# Altium project Apalis Evaluation Board.PrjPCB (part 2 of 5)

## Sheet JTAG.SchDoc: Apalis Evaluation Board 1.1
size A3; Organization: Toradex AG; Address1: Altsagenstrasse 5; Address2: Horw; Address3: 6048; Address4: Switzerland; DocumentNumber: 31; Revision: V1.1; SheetNumber: 31; SheetTotal: 32; PageSetup: Record=PageOptions|CenterHorizontal=True|CenterVertical=True|PrintScale=0.73|XCorrection=1.00|YCorrection=1.00|PrintKind=0|BorderSize=5000000|LeftOffset=0|BottomOffset=0|Orientation=2|PaperLength=1000|PaperWidth=1000|Scale=100|PaperSource=7|PrintQuality=-4|MediaType=1|DitherType=10|PaperKind=A4|PrintScaleMode=1
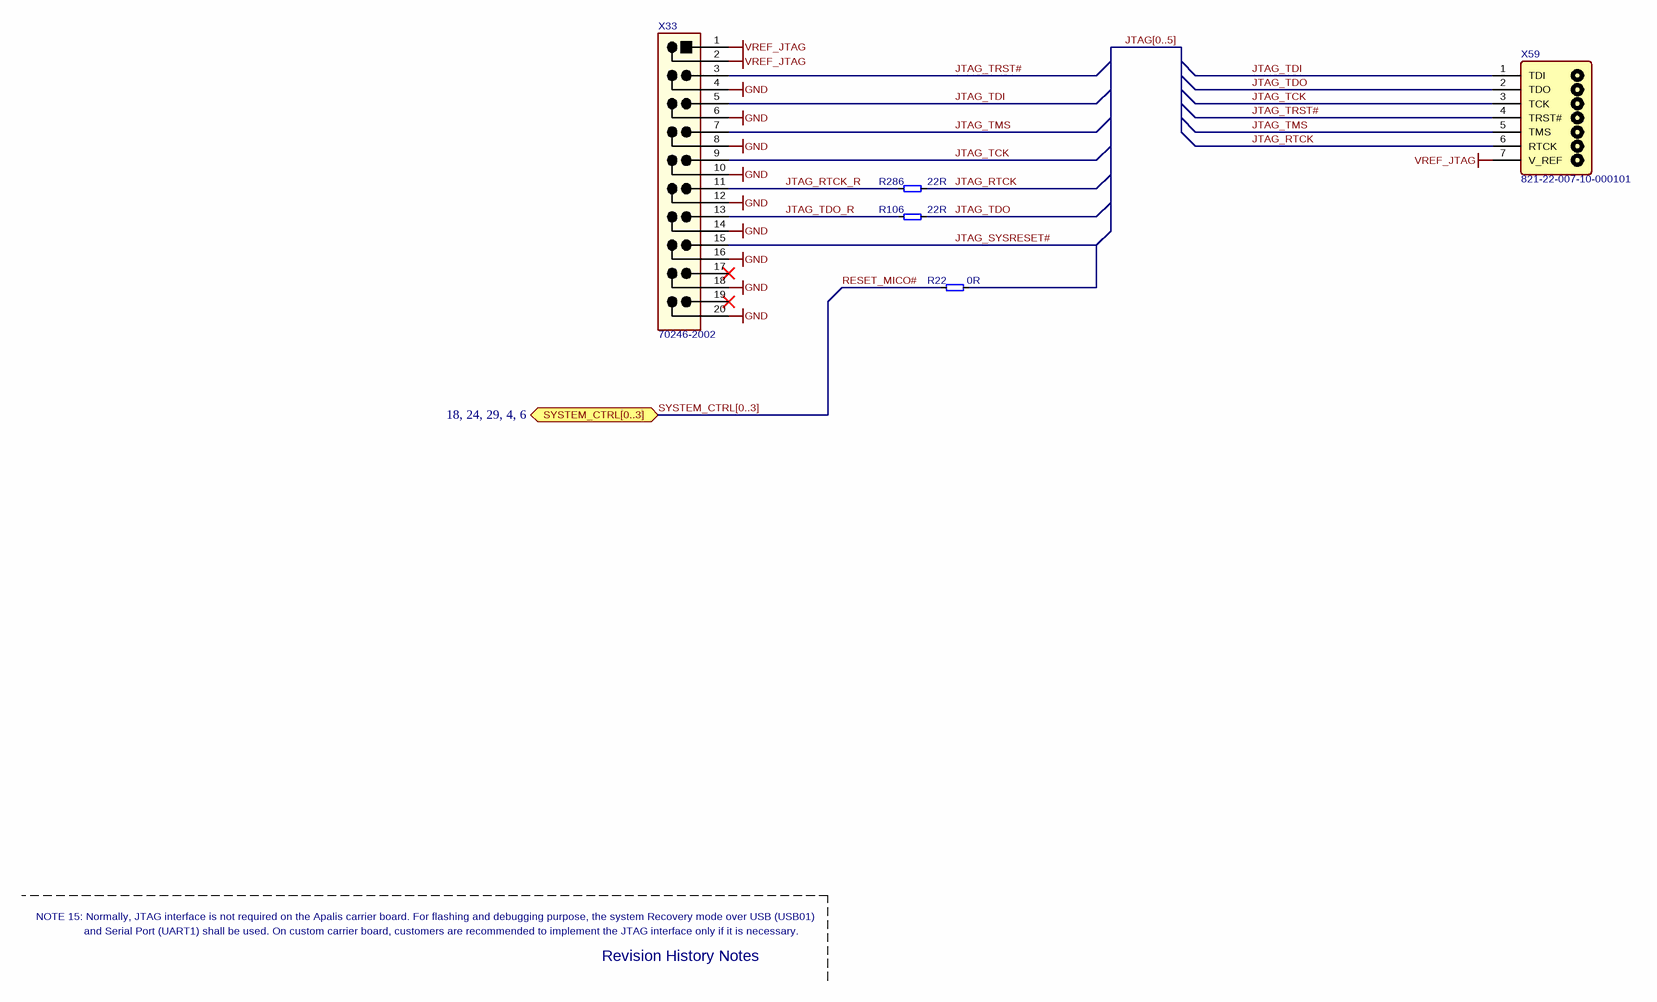
[diagram p9: JTAG.SchDoc]

### Parts
R22  0R  [T_RESC0603X30N]
R106  22R  [T_RESC0603X30N]
R286  22R  [T_RESC0603X30N]
X33  70246-2002  [T_Molex_70246-2002]
X59  821-22-007-10-000101  [T_MILL-MAX_821-22-007-10-000101]

### Ports
SYSTEM_CTRL[0..3] (bidir, see 18, 24, 29, 4, 6)

### Nets
GND: X33.4 X33.6 X33.8 X33.10 X33.12 X33.14 X33.16 X33.18 X33.20
VREF_JTAG: X33.1 X33.2 X59.7(V_REF)
JTAG_RTCK: R286.2 X59.6(RTCK)
JTAG_RTCK_R: R286.1 X33.11
JTAG_SYSRESET#: R22.2 X33.15
JTAG_TCK: X33.9 X59.3(TCK)
JTAG_TDI: X33.5 X59.1(TDI)
JTAG_TDO: R106.2 X59.2(TDO)
JTAG_TDO_R: R106.1 X33.13
JTAG_TMS: X33.7 X59.5(TMS)
JTAG_TRST#: X33.3 X59.4(TRST#)
RESET_MICO#: R22.1

Not connected (* = marked no-connect by the designer): X33 17* 19*

### Buses and harness runs
bus JTAG[0..5]
bus SYSTEM_CTRL[0..3] = port SYSTEM_CTRL[0..3]

### Notes on the sheet
- NOTE 15: Normally, JTAG interface is not required on the Apalis carrier board. For flashing and debugging purpose, the system Recovery mode over USB (USB01)
- and Serial Port (UART1) shall be used. On custom carrier board, customers are recommended to implement the JTAG interface only if it is necessary.
- Revision History Notes
- Title
- Size:
- Date:
- A3
- Number:
- Time:
- Revision:
- Sheet
- of
- File:

### Library data of the parts
R22 = R-0R-63mW-1%-0603: Resistor 0 ohm 63mW 1% 0603; Rating: 63mW; Tolerance: 1%; Value: 0R
R106 R286 = R-22R-63mW-5%-0603: Resistor 22 ohm 63mW 5% 0603; Rating: 63mW; Tolerance: 5%; Value: 22R
X33 = CON-Molex-70246-2002: Header shrouded male, 2x10 pin 2.54mm pitch; Manufacturer Name: Molex; No. of ways: 2x10; Pitch: 2.54mm; Manufacturer Part No.: 70246-2002
X59 = CON-MM-821-22-007-10-000101: JTAG Pogo pins; Manufacturer Name: Mill-Max; Manufacturer Part No.: 821-22-007-10-000101

## Sheet LEDs_Switches.SchDoc: Apalis Evaluation Board 1.1
size A3; Organization: Toradex AG; Address1: Altsagenstrasse 5; Address2: Horw; Address3: 6048; Address4: Switzerland; DocumentNumber: 30; Revision: V1.1; SheetNumber: 30; SheetTotal: 32; PageSetup: Record=PageOptions|CenterHorizontal=True|CenterVertical=True|PrintScale=0.73|XCorrection=1.00|YCorrection=1.00|PrintKind=0|BorderSize=5000000|LeftOffset=0|BottomOffset=0|Orientation=2|PaperLength=1000|PaperWidth=1000|Scale=100|PaperSource=7|PrintQuality=-4|MediaType=1|DitherType=10|PaperKind=A4|PrintScaleMode=1
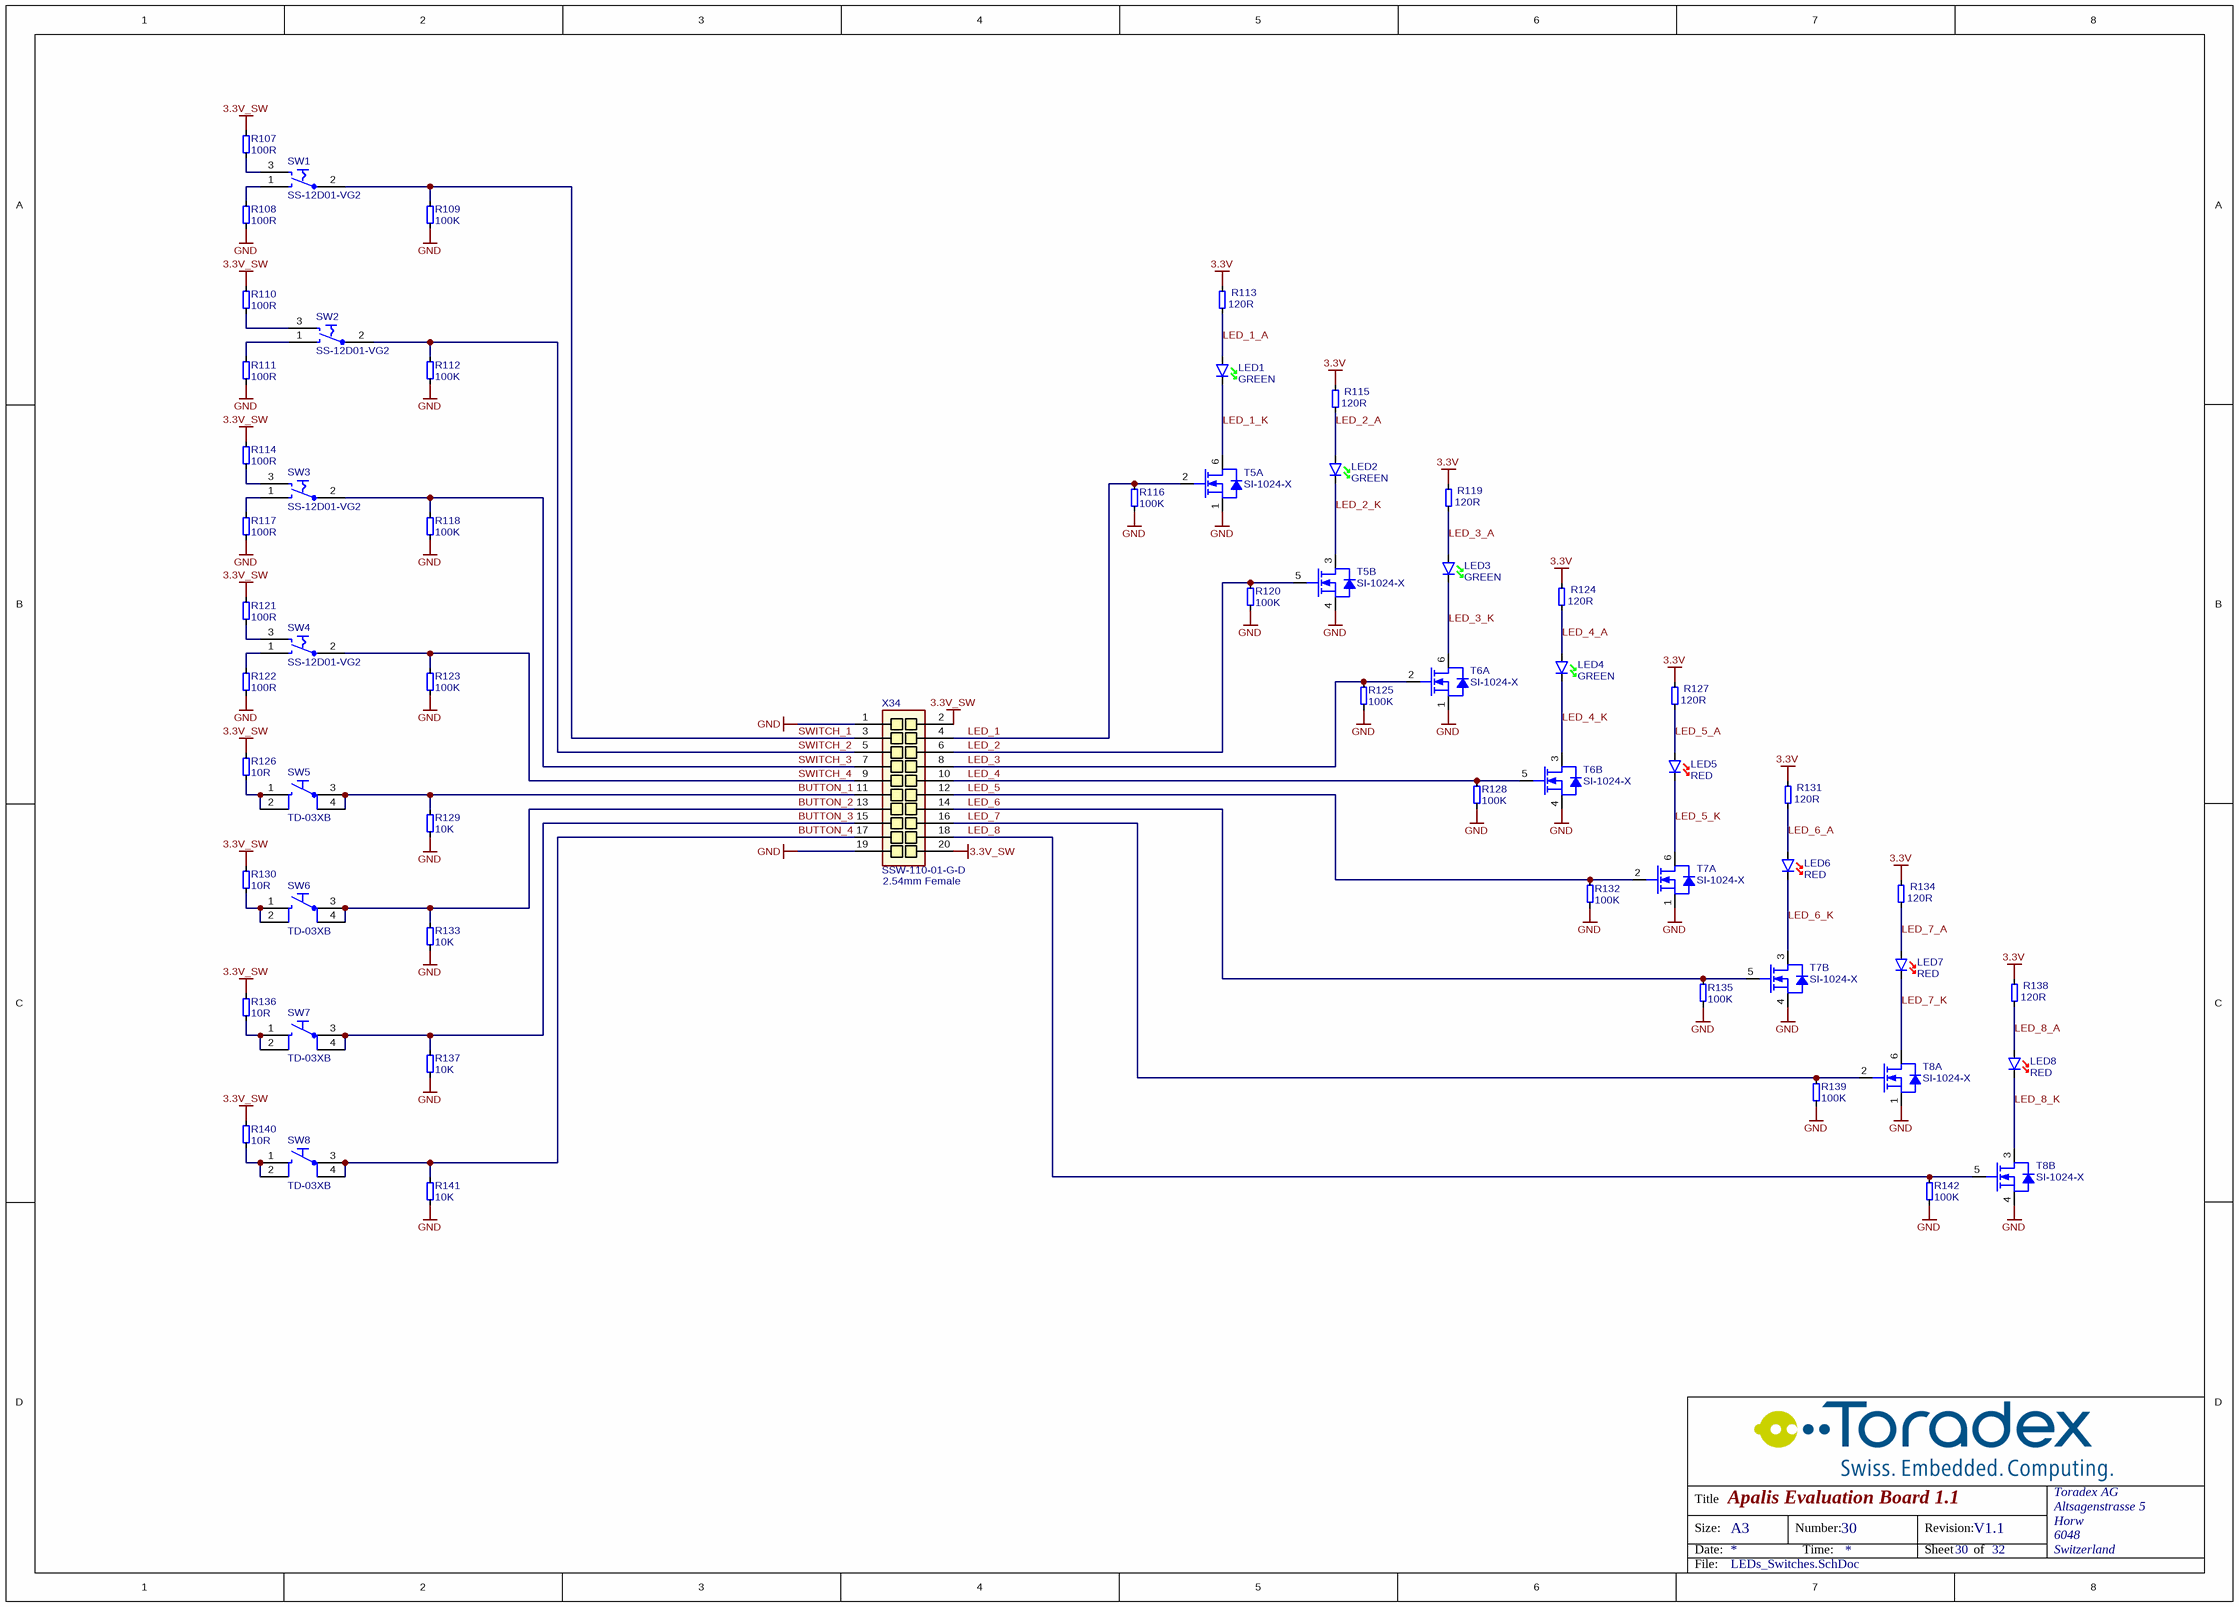
[diagram p10: LEDs_Switches.SchDoc]

### Parts
LED1  Color: GREEN  [T_Osram_T670_GREEN]  (hidden comment: LG T670-K1L2-1)
LED2  Color: GREEN  [T_Osram_T670_GREEN]  (hidden comment: LG T670-K1L2-1)
LED3  Color: GREEN  [T_Osram_T670_GREEN]  (hidden comment: LG T670-K1L2-1)
LED4  Color: GREEN  [T_Osram_T670_GREEN]  (hidden comment: LG T670-K1L2-1)
LED5  Color: RED  [T_Osram_T670_RED]  (hidden comment: LS T670-K1L2-1)
LED6  Color: RED  [T_Osram_T670_RED]  (hidden comment: LS T670-K1L2-1)
LED7  Color: RED  [T_Osram_T670_RED]  (hidden comment: LS T670-K1L2-1)
LED8  Color: RED  [T_Osram_T670_RED]  (hidden comment: LS T670-K1L2-1)
R107  100R  [T_RESC0603X30N]
R108  100R  [T_RESC0603X30N]
R109  100K  [T_RESC0603X30N]
R110  100R  [T_RESC0603X30N]
R111  100R  [T_RESC0603X30N]
R112  100K  [T_RESC0603X30N]
R113  120R  [T_RESC0603X30N]
R114  100R  [T_RESC0603X30N]
R115  120R  [T_RESC0603X30N]
R116  100K  [T_RESC0603X30N]
R117  100R  [T_RESC0603X30N]
R118  100K  [T_RESC0603X30N]
R119  120R  [T_RESC0603X30N]
R120  100K  [T_RESC0603X30N]
R121  100R  [T_RESC0603X30N]
R122  100R  [T_RESC0603X30N]
R123  100K  [T_RESC0603X30N]
R124  120R  [T_RESC0603X30N]
R125  100K  [T_RESC0603X30N]
R126  10R  [T_RESC0603X30N]
R127  120R  [T_RESC0603X30N]
R128  100K  [T_RESC0603X30N]
R129  10K  [T_RESC0603X30N]
R130  10R  [T_RESC0603X30N]
R131  120R  [T_RESC0603X30N]
R132  100K  [T_RESC0603X30N]
R133  10K  [T_RESC0603X30N]
R134  120R  [T_RESC0603X30N]
R135  100K  [T_RESC0603X30N]
R136  10R  [T_RESC0603X30N]
R137  10K  [T_RESC0603X30N]
R138  120R  [T_RESC0603X30N]
R139  100K  [T_RESC0603X30N]
R140  10R  [T_RESC0603X30N]
R141  10K  [T_RESC0603X30N]
R142  100K  [T_RESC0603X30N]
SW1  SS-12D01-VG2  [T_See-Plus_SS-12D01-VG2]
SW2  SS-12D01-VG2  [T_See-Plus_SS-12D01-VG2]
SW3  SS-12D01-VG2  [T_See-Plus_SS-12D01-VG2]
SW4  SS-12D01-VG2  [T_See-Plus_SS-12D01-VG2]
SW5  TD-03XB  [T_WMF_TD-03XB]
SW6  TD-03XB  [T_WMF_TD-03XB]
SW7  TD-03XB  [T_WMF_TD-03XB]
SW8  TD-03XB  [T_WMF_TD-03XB]
T5  Manufacturer Part No.: SI-1024-X  [SOTFL50P160X60-6N]  (hidden comment: T-Vishay-SI-1024X-N)  (parts A,B of 2)
T6  Manufacturer Part No.: SI-1024-X  [SOTFL50P160X60-6N]  (hidden comment: T-Vishay-SI-1024X-N)  (parts A,B of 2)
T7  Manufacturer Part No.: SI-1024-X  [SOTFL50P160X60-6N]  (hidden comment: T-Vishay-SI-1024X-N)  (parts A,B of 2)
T8  Manufacturer Part No.: SI-1024-X  [SOTFL50P160X60-6N]  (hidden comment: T-Vishay-SI-1024X-N)  (parts A,B of 2)
X34  SSW-110-01-G-D  [T_Samtec_SSW-110-01-G-D]

### Nets
3.3V: R113.2 R115.2 R119.2 R124.2 R127.2 R131.2 R134.2 R138.2
3.3V_SW: R107.2 R110.2 R114.2 R121.2 R126.2 R130.2 R136.2 R140.2 X34.2 X34.20
GND: R108.1 R109.1 R111.1 R112.1 R116.1 R117.1 R118.1 R120.1 R122.1 R123.1 R125.1 R128.1 R129.1 R132.1 R133.1 R135.1 R137.1 R139.1 R141.1 R142.1 T5.1(S) T5.4(S) T6.1(S) T6.4(S) T7.1(S) T7.4(S) T8.1(S) T8.4(S) X34.1 X34.19
BUTTON_1: R129.2 SW5.3 SW5.4 X34.11
BUTTON_2: R133.2 SW6.3 SW6.4 X34.13
BUTTON_3: R137.2 SW7.3 SW7.4 X34.15
BUTTON_4: R141.2 SW8.3 SW8.4 X34.17
LED_1: R116.2 T5.2(G) X34.4
LED_1_A: LED1.A R113.1
LED_1_K: LED1.K T5.6(D)
LED_2: R120.2 T5.5(G) X34.6
LED_2_A: LED2.A R115.1
LED_2_K: LED2.K T5.3(D)
LED_3: R125.2 T6.2(G) X34.8
LED_3_A: LED3.A R119.1
LED_3_K: LED3.K T6.6(D)
LED_4: R128.2 T6.5(G) X34.10
LED_4_A: LED4.A R124.1
LED_4_K: LED4.K T6.3(D)
LED_5: R132.2 T7.2(G) X34.12
LED_5_A: LED5.A R127.1
LED_5_K: LED5.K T7.6(D)
LED_6: R135.2 T7.5(G) X34.14
LED_6_A: LED6.A R131.1
LED_6_K: LED6.K T7.3(D)
LED_7: R139.2 T8.2(G) X34.16
LED_7_A: LED7.A R134.1
LED_7_K: LED7.K T8.6(D)
LED_8: R142.2 T8.5(G) X34.18
LED_8_A: LED8.A R138.1
LED_8_K: LED8.K T8.3(D)
SWITCH_1: R109.2 SW1.2 X34.3
SWITCH_2: R112.2 SW2.2 X34.5
SWITCH_3: R118.2 SW3.2 X34.7
SWITCH_4: R123.2 SW4.2 X34.9
NetR107_1: R107.1 SW1.3
NetR108_2: R108.2 SW1.1
NetR110_1: R110.1 SW2.3
NetR111_2: R111.2 SW2.1
NetR114_1: R114.1 SW3.3
NetR117_2: R117.2 SW3.1
NetR121_1: R121.1 SW4.3
NetR122_2: R122.2 SW4.1
NetR126_1: R126.1 SW5.1 SW5.2
NetR130_1: R130.1 SW6.1 SW6.2
NetR136_1: R136.1 SW7.1 SW7.2
NetR140_1: R140.1 SW8.1 SW8.2

### Notes on the sheet
- (near X34) 2.54mm Female
- Title
- Size:
- Date:
- A3
- Number:
- Time:
- Revision:
- Sheet
- of
- File:

### Library data of the parts
LED1-LED4 = LED-Osram-T670-K1L2-1: LED green Osram LG T670-K1L2-1; Manufacturer Name: Osram; Manufacturer Part No.: LG T670-K1L2-1
LED5-LED8 = LED-Osram-LS T670-K1L2-1: LED red, Osram LS T670-K1L2-1; Manufacturer Name: Osram; Manufacturer Part No.: LS T670-K1L2-1
R107 R108 R110 R111 R114 R117 R121 R122 = R-100R-63mW-5%-0603: Resistor 100 ohm 63mW 5% 0603; Rating: 63mW; Tolerance: 5%; Value: 100R
R109 R112 R116 R118 R120 R123 R125 R128 R132 R135 R139 R142 = R-100KR-63mW-5%-0603: Resistor 100 Kohm 63mW 5% 0603; Value: 100KR; Rating: 63mW; Tolerance: 5%
R113 R115 R119 R124 R127 R131 R134 R138 = R-120R-63mW-5%-0603: Resistor 120 ohm 63mW 5% 0603; Rating: 63mW; Tolerance: 5%; Value: 120R
R126 R130 R136 R140 = R-10R-63mW-5%-0603: Resistor 10 ohm 63mW 5% 0603; Rating: 63mW; Tolerance: 5%; Value: 10R
R129 R133 R137 R141 = R-10KR-63mW-5%-0603: Resistor 10 Kohm 63mW 5% 0603; Value: 10KR; Rating: 63mW; Tolerance: 5%
SW1-SW4 = SW-See-Plus-SS-12D01-VG2: Switch; Rating: 0.3A; Manufacturer Name: See-Plus; Manufacturer Part No.: SS-12D01-VG2
SW5-SW8 = SW-WMF-TD-03XB: Push Button; Manufacturer Name: WMF; Rating: 50mA; Manufacturer Part No.: TD-03XB
T5-T8 = T-Vishay-SI-1024X-N: Dual N-Channel 20V (D-S)  MOSFET; Manufacturer Name: Vishay
X34 = CON-Samtec-SSW-110-01-G-D: Receptacle Female Socket 2x10 Pins, 2.54 mm pitch; Manufacturer Name: Samtec; Pitch: 2.54mm; No. of wasy: 2x10; Manufacturer Part No.: SSW-110-01-G-D

## Sheet PCI_Express_Connectors.SchDoc: Apalis Evaluation Board 1.1
size A3; Organization: Toradex AG; Address1: Altsagenstrasse 5; Address2: Horw; Address3: 6048; Address4: Switzerland; DocumentNumber: 27; Revision: V1.1; SheetNumber: 27; SheetTotal: 32; PageSetup: Record=PageOptions|CenterHorizontal=True|CenterVertical=True|PrintScale=0.73|XCorrection=1.00|YCorrection=1.00|PrintKind=0|BorderSize=5000000|LeftOffset=0|BottomOffset=0|Orientation=2|PaperLength=1000|PaperWidth=1000|Scale=100|PaperSource=7|PrintQuality=-4|MediaType=1|DitherType=10|PaperKind=A4|PrintScaleMode=1
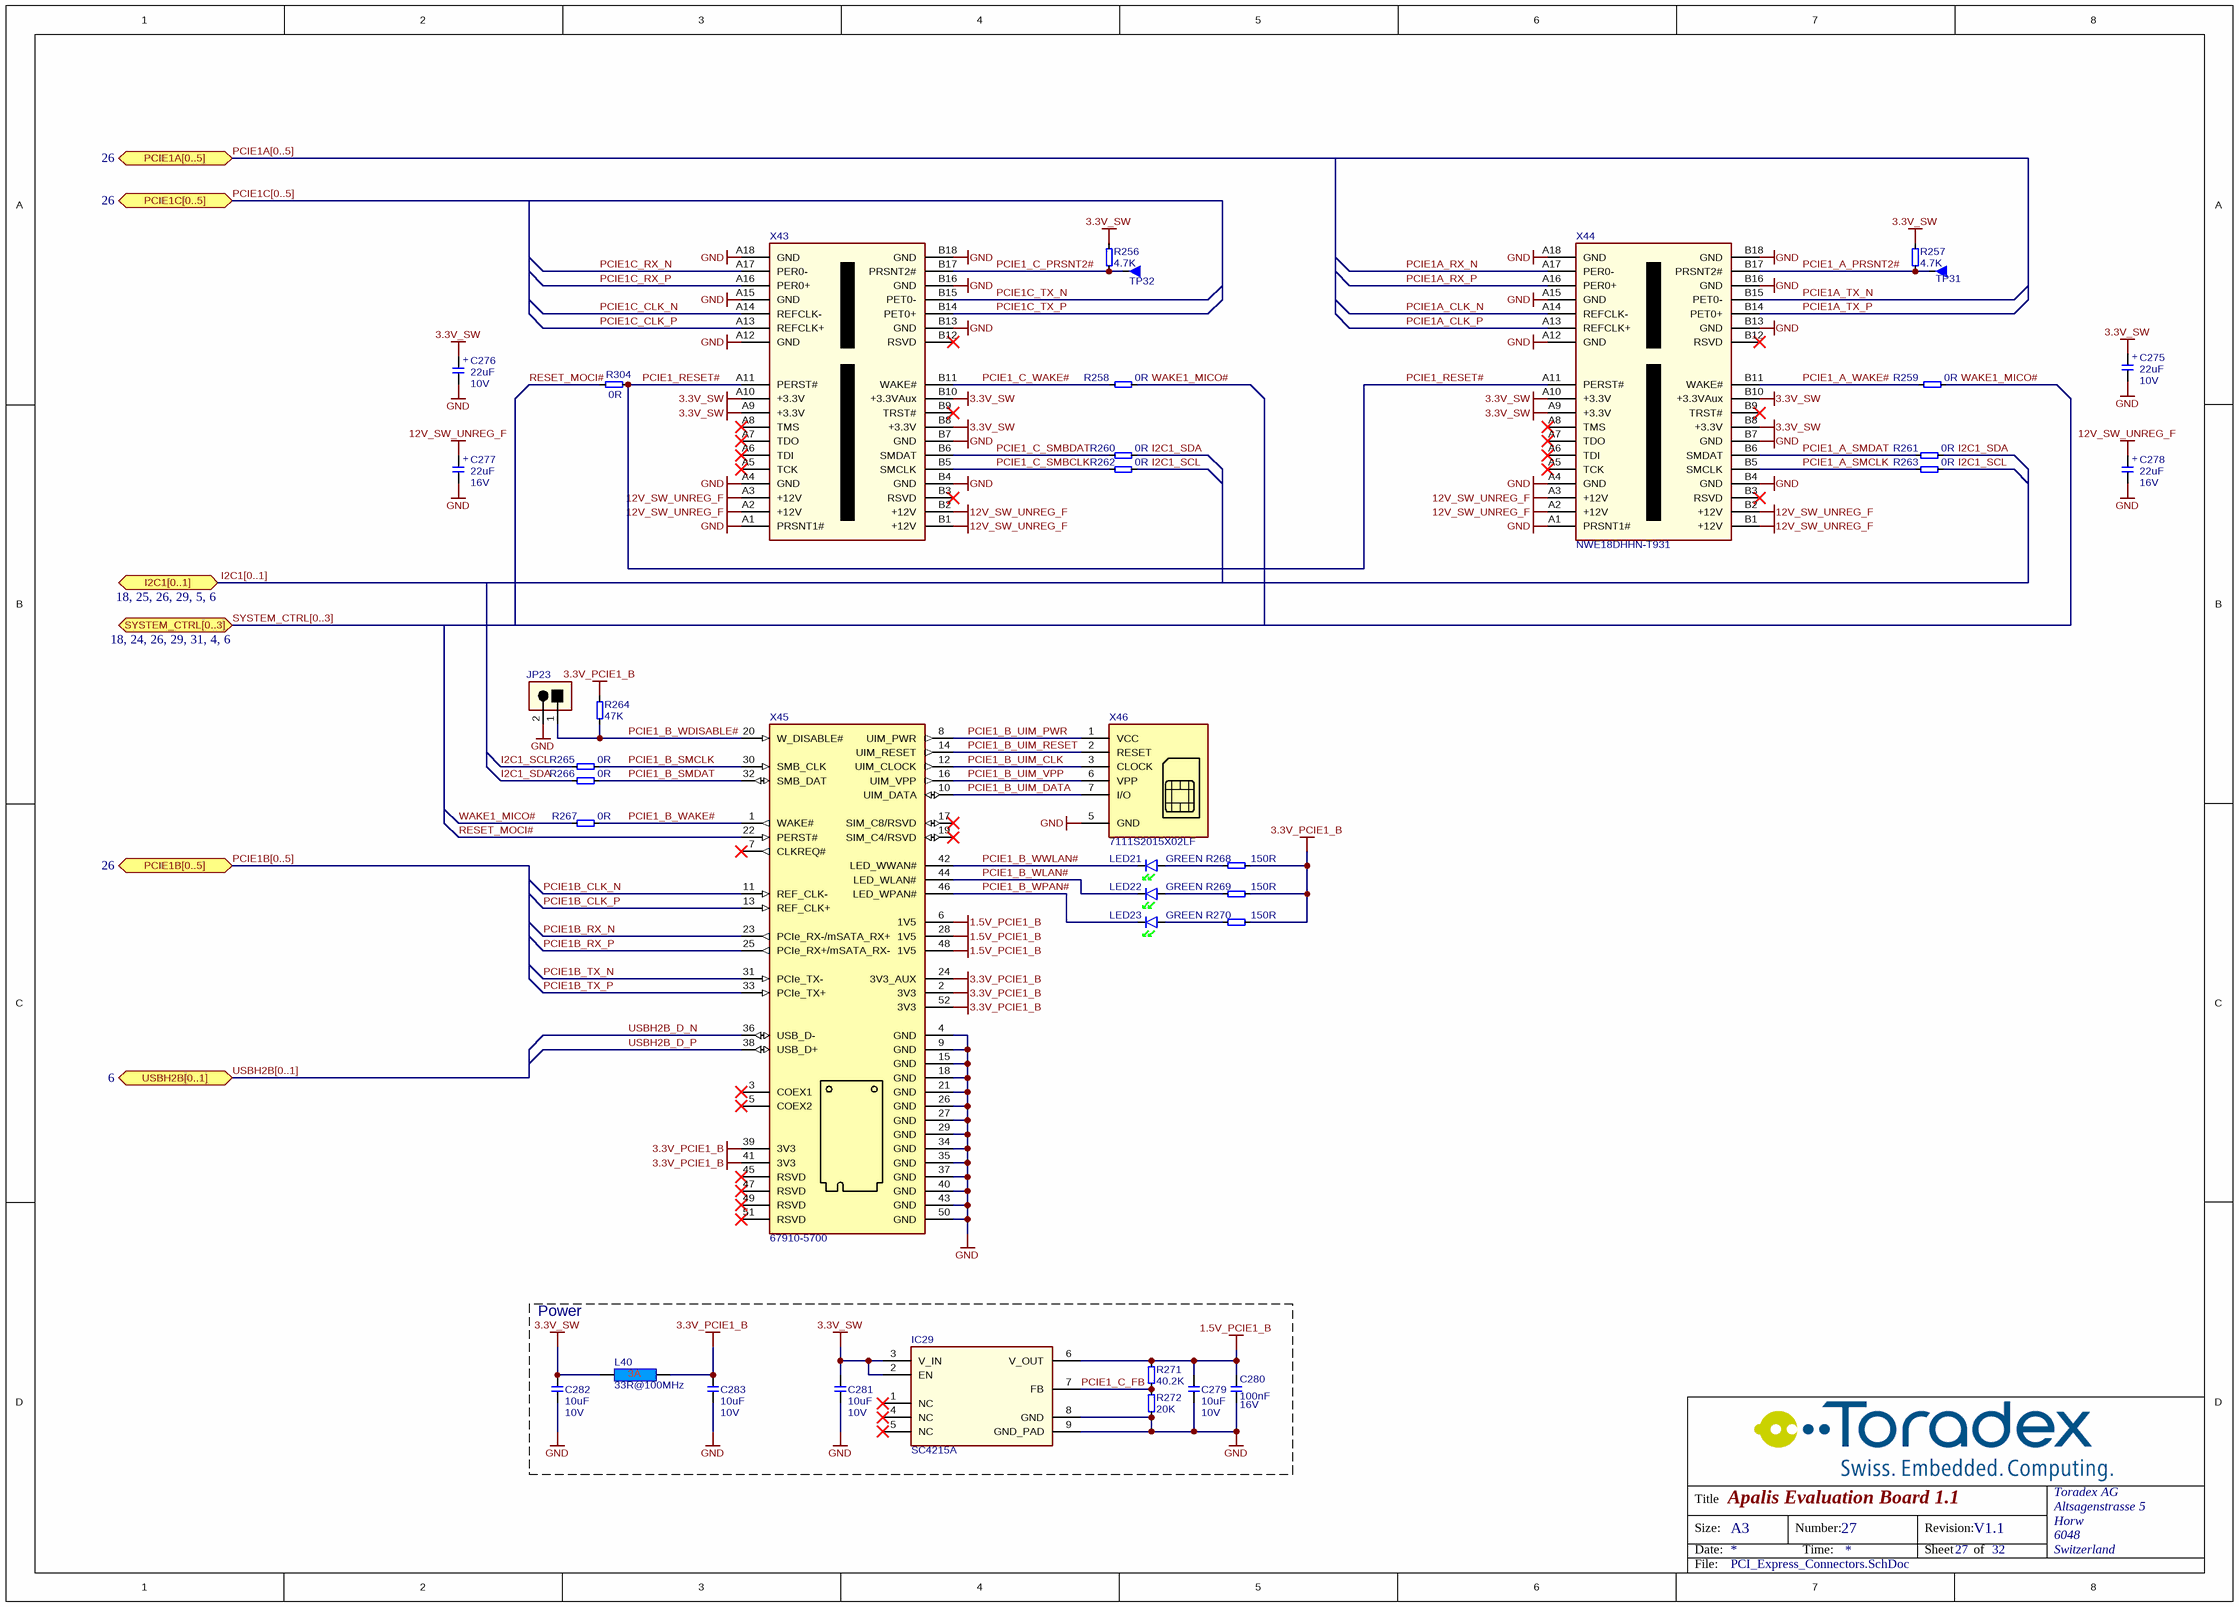
[diagram p11: PCI_Express_Connectors.SchDoc]

### Parts
C275  Rating: 10V  [CAPMP3528X210N]  (hidden comment: 22uF)
C276  Rating: 10V  [CAPMP3528X210N]  (hidden comment: 22uF)
C277  Rating: 16V  [CAPMP3528X210N]  (hidden comment: 22uF)
C278  Rating: 16V  [CAPMP3528X210N]  (hidden comment: 22uF)
C279  Rating: 10V  [T_CAPC0603X33N]  (hidden comment: 10uF)
C280  Rating: 16V  [T_CAPC0603X33N]  (hidden comment: 100nF)
C281  Rating: 10V  [T_CAPC0603X33N]  (hidden comment: 10uF)
C282  Rating: 10V  [T_CAPC0603X33N]  (hidden comment: 10uF)
C283  Rating: 10V  [T_CAPC0603X33N]  (hidden comment: 10uF)
IC29  Part No.: SC4215A  [SOIC127P650X175_HS-8N]  (hidden comment: IC-Semtech-SC4215A)
JP23  TSW-101-07-G-D  [T_Samtec_TSW-101-07-G-D]  (value not drawn)
L40  33R@100MHz  [INDC1608X95N]
LED21  Color: GREEN  [T_Osram_T670_GREEN]  (hidden comment: LG T670-K1L2-1)
LED22  Color: GREEN  [T_Osram_T670_GREEN]  (hidden comment: LG T670-K1L2-1)
LED23  Color: GREEN  [T_Osram_T670_GREEN]  (hidden comment: LG T670-K1L2-1)
R256  4.7K  [t_RESC0603X30N]
R257  4.7K  [t_RESC0603X30N]
R258  0R  [T_RESC0603X30N]
R259  0R  [T_RESC0603X30N]
R260  0R  [T_RESC0603X30N]
R261  0R  [T_RESC0603X30N]
R262  0R  [T_RESC0603X30N]
R263  0R  [T_RESC0603X30N]
R264  47K  [T_RESC0603X30N]
R265  0R  [T_RESC0603X30N]
R266  0R  [T_RESC0603X30N]
R267  0R  [T_RESC0603X30N]
R268  150R  [T_RESC0603X30N]
R269  150R  [T_RESC0603X30N]
R270  150R  [T_RESC0603X30N]
R271  40.2K  [T_RESC0603X30N]
R272  20K  [T_RESC0603X30N]
R304  0R  [T_RESC0603X30N]
TP31  Testpin  [T_TP-THT]  (value not drawn)
TP32  Testpin  [T_TP-THT]  (value not drawn)
X43  NWE18DHHN-T931  [T_Sullins_NWE18DHHN-T931]  (value not drawn)
X44  NWE18DHHN-T931  [T_Sullins_NWE18DHHN-T931]
X45  67910-5700  [T_Molex_67910-5700]
X46  7111S2015X02LF  [T_FCI_7111S2015X02LF]

### Blocks framed on the sheet
Power: C279-C283 IC29 L40 R271 R272

### Ports
I2C1[0..1] (bidir, see 18, 25, 26, 29, 5, 6), PCIE1A[0..5] (bidir, see 26), PCIE1B[0..5] (bidir, see 26), PCIE1C[0..5] (bidir, see 26), SYSTEM_CTRL[0..3] (bidir, see 18, 24, 26, 29, 31, 4, 6), USBH2B[0..1] (bidir, see 6)

### Nets
1.5V_PCIE1_B: C279.2 C280.2 IC29.6(V_OUT) R271.2 X45.6(1V5) X45.28(1V5) X45.48(1V5)
3.3V_PCIE1_B: C283.2 L40.2 R264.2 R268.2 R269.2 R270.2 X45.2(3V3) X45.24(3V3_AUX) X45.39(3V3) X45.41(3V3) X45.52(3V3)
3.3V_SW: C275.1 C276.1 C281.2 C282.2 IC29.2(EN) IC29.3(V_IN) L40.1 R256.2 R257.2 X43.A9(+3.3V) X43.A10(+3.3V) X43.B8(+3.3V) X43.B10(+3.3VAux) X44.A9(+3.3V) X44.A10(+3.3V) X44.B8(+3.3V) X44.B10(+3.3VAux)
12V_SW_UNREG_F: C277.1 C278.1 X43.A2(+12V) X43.A3(+12V) X43.B1(+12V) X43.B2(+12V) X44.A2(+12V) X44.A3(+12V) X44.B1(+12V) X44.B2(+12V)
GND: C275.2 C276.2 C277.2 C278.2 C279.1 C280.1 C281.1 C282.1 C283.1 IC29.8(GND) IC29.9(GND_PAD) JP23.2 R272.1 X43.A1(PRSNT1#) X43.A4(GND) X43.A12(GND) X43.A15(GND) X43.A18(GND) X43.B4(GND) X43.B7(GND) X43.B13(GND) X43.B16(GND) X43.B18(GND) X44.A1(PRSNT1#) X44.A4(GND) X44.A12(GND) X44.A15(GND) X44.A18(GND) X44.B4(GND) X44.B7(GND) X44.B13(GND) X44.B16(GND) X44.B18(GND) X45.4(GND) X45.9(GND) X45.15(GND) X45.18(GND) X45.21(GND) X45.26(GND) X45.27(GND) X45.29(GND) X45.34(GND) X45.35(GND) X45.37(GND) X45.40(GND) X45.43(GND) X45.50(GND) X46.5(GND)
I2C1_SCL: R262.2 R263.2 R265.1
I2C1_SDA: R260.2 R261.2 R266.1
PCIE1_A_PRSNT2#: R257.1 TP31.1 X44.B17(PRSNT2#)
PCIE1_A_SMCLK: R263.1 X44.B5(SMCLK)
PCIE1_A_SMDAT: R261.1 X44.B6(SMDAT)
PCIE1_A_WAKE#: R259.1 X44.B11(WAKE#)
PCIE1_B_SMCLK: R265.2 X45.30(SMB_CLK)
PCIE1_B_SMDAT: R266.2 X45.32(SMB_DAT)
PCIE1_B_UIM_CLK: X45.12(UIM_CLOCK) X46.3(CLOCK)
PCIE1_B_UIM_DATA: X45.10(UIM_DATA) X46.7(I/O)
PCIE1_B_UIM_PWR: X45.8(UIM_PWR) X46.1(VCC)
PCIE1_B_UIM_RESET: X45.14(UIM_RESET) X46.2(RESET)
PCIE1_B_UIM_VPP: X45.16(UIM_VPP) X46.6(VPP)
PCIE1_B_WAKE#: R267.2 X45.1(WAKE#)
PCIE1_B_WDISABLE#: JP23.1 R264.1 X45.20(W_DISABLE#)
PCIE1_B_WLAN#: LED22.K X45.44(LED_WLAN#)
PCIE1_B_WPAN#: LED23.K X45.46(LED_WPAN#)
PCIE1_B_WWLAN#: LED21.K X45.42(LED_WWAN#)
PCIE1_C_FB: IC29.7(FB) R271.1 R272.2
PCIE1_C_PRSNT2#: R256.1 TP32.1 X43.B17(PRSNT2#)
PCIE1_C_SMBCLK: R262.1 X43.B5(SMCLK)
PCIE1_C_SMBDAT: R260.1 X43.B6(SMDAT)
PCIE1_C_WAKE#: R258.1 X43.B11(WAKE#)
PCIE1_RESET#: R304.2 X43.A11(PERST#) X44.A11(PERST#)
PCIE1A_CLK_N: X44.A14(REFCLK-)
PCIE1A_CLK_P: X44.A13(REFCLK+)
PCIE1A_RX_N: X44.A17(PER0-)
PCIE1A_RX_P: X44.A16(PER0+)
PCIE1A_TX_N: X44.B15(PET0-)
PCIE1A_TX_P: X44.B14(PET0+)
PCIE1B_CLK_N: X45.11(REF_CLK-)
PCIE1B_CLK_P: X45.13(REF_CLK+)
PCIE1B_RX_N: X45.23(PCIe_RX-/mSATA_RX+)
PCIE1B_RX_P: X45.25(PCIe_RX+/mSATA_RX-)
PCIE1B_TX_N: X45.31(PCIe_TX-)
PCIE1B_TX_P: X45.33(PCIe_TX+)
PCIE1C_CLK_N: X43.A14(REFCLK-)
PCIE1C_CLK_P: X43.A13(REFCLK+)
PCIE1C_RX_N: X43.A17(PER0-)
PCIE1C_RX_P: X43.A16(PER0+)
PCIE1C_TX_N: X43.B15(PET0-)
PCIE1C_TX_P: X43.B14(PET0+)
RESET_MOCI#: R304.1 X45.22(PERST#)
USBH2B_D_N: X45.36(USB_D-)
USBH2B_D_P: X45.38(USB_D+)
WAKE1_MICO#: R258.2 R259.2 R267.1
NetLED21_A: LED21.A R268.1
NetLED22_A: LED22.A R269.1
NetLED23_A: LED23.A R270.1

Not connected (* = marked no-connect by the designer): IC29 1(NC)* 4(NC)* 5(NC)*; X43 A5(TCK)* A6(TDI)* A7(TDO)* A8(TMS)* B3(RSVD)* B9(TRST#)* B12(RSVD)*; X44 A5(TCK)* A6(TDI)* A7(TDO)* A8(TMS)* B3(RSVD)* B9(TRST#)* B12(RSVD)*; X45 3(COEX1)* 5(COEX2)* 7(CLKREQ#)* 17(SIM_C8/RSVD)* 19(SIM_C4/RSVD)* 45(RSVD)* 47(RSVD)* 49(RSVD)* 51(RSVD)*

### Buses and harness runs
bus I2C1[0..1] = port I2C1[0..1]
bus PCIE1A[0..5] = port PCIE1A[0..5]
bus PCIE1B[0..5] = port PCIE1B[0..5]
bus PCIE1C[0..5] = port PCIE1C[0..5]
bus SYSTEM_CTRL[0..3] = port SYSTEM_CTRL[0..3]
bus USBH2B[0..1] = port USBH2B[0..1]

### Notes on the sheet
- Title
- Size:
- Date:
- A3
- Number:
- Time:
- Revision:
- Sheet
- of
- File:
- (in symbol C-TA-22uF-10V-20%-3528) +
- (in symbol C-TA-22uF-16V-20%-3528) +

### Library data of the parts
C275 C276 = C-TA-22uF-10V-20%-3528: Capacitor TA 22uF 10V 20% 3528; Tolerance: 20%; Type: TA; Value: 22uF
C277 C278 = C-TA-22uF-16V-20%-3528: Capacitor TA 22uF 16V 20% 3528; Tolerance: 20%; Type: TA; Value: 22uF
C279 C281-C283 = C-X5R-10uF-10V-20%-0603: Capacitor Ceramic X5R 10uF 10V 20% 0603; Tolerance: 20%; Type: X5R; Value: 10uF
C280 = C-X7R-100nF-16V-10%-0603: Capacitor Ceramic X7R 100nF 16V 10% 0603; Tolerance: 10%; Type: X7R; Value: 100nF
IC29 = IC-Semtech-SC4215A: LDO TO 2A; Manufacturer Name: Semtech
JP23 = CON-Samtec-TSW-101-07-G-D: Header male, 1x2 Pins, 2.54 mm pitch; Manufacturer Name: Samtec; Pitch: 2.54 mm; No. of ways: 1x2; Manufacturer Part no.: TSW-101-07-G-D
L40 = L-33R@100MHz-3A-25%-0603: 33R@100MHz 3A EMI FILTER; Tolerance: 25%; Rating: 3A; Value: 33R@100MHz
LED21-LED23 = LED-Osram-T670-K1L2-1: LED green Osram LG T670-K1L2-1; Manufacturer Name: Osram; Manufacturer Part No.: LG T670-K1L2-1
R256 R257 = R-4.7kR-63mW-5%-0603: Resistor 4.7 Kohm 63mW 5% 0603; Value: 4.7KR; Rating: 63mW; Tolerance: 5%
R258-R263 R265-R267 R304 = R-0R-63mW-1%-0603: Resistor 0 ohm 63mW 1% 0603; Rating: 63mW; Tolerance: 1%; Value: 0R
R264 = R-47KR-63mW-5%-0603: Resistor 47 Kohm 63mW 5% 0603; Value: 47KR; Rating: 63mW; Tolerance: 5%
R268-R270 = R-150R-63mW-1%-0603: Resistor 150 ohm 63mW 1% 0603; Rating: 63mW; Tolerance: 1%; Value: 150R
R271 = R-40.2KR-63mW-1%-0603: Resistor 40.2 Kohm 63mW 1% 0603; Value: 40.2KR; Rating: 63mW; Tolerance: 1%
R272 = R-20KR-63mW-1%-0603: Resistor 20 Kohm 63mW 1% 0603; Value: 20KR; Rating: 63mW; Tolerance: 1%
TP31 TP32 = Testpin: Testpin TH
X43 X44 = CON-Sullins-NWE18DHHN-T931: PCI EXPRESS 36POS; No. of ways: 36; Manufacturer Name: Sullins
  X44: Manufacturer Part No.: NWE18DHHN-T931
X45 = CON-Molex-67910-5700: PCIe_Mini Card Holder; Manufacturer Name: Molex; Part No.: 67910-5700
X46 = CON-FCI-7111S2015X02LF: 6 Contacts Sim Card Holder; Manufacturer Name: FCI; Part No.: 7111S2015X02LF

## Sheet PCI_Express_Switch.SchDoc: Apalis Evaluation Board 1.1
size A3; Organization: Toradex AG; Address1: Altsagenstrasse 5; Address2: Horw; Address3: 6048; Address4: Switzerland; DocumentNumber: 26; Revision: V1.1; SheetNumber: 26; SheetTotal: 32; PageSetup: Record=PageOptions|CenterHorizontal=True|CenterVertical=True|PrintScale=0.73|XCorrection=1.00|YCorrection=1.00|PrintKind=0|BorderSize=5000000|LeftOffset=0|BottomOffset=0|Orientation=2|PaperLength=1000|PaperWidth=1000|Scale=100|PaperSource=7|PrintQuality=-4|MediaType=1|DitherType=10|PaperKind=A4|PrintScaleMode=1
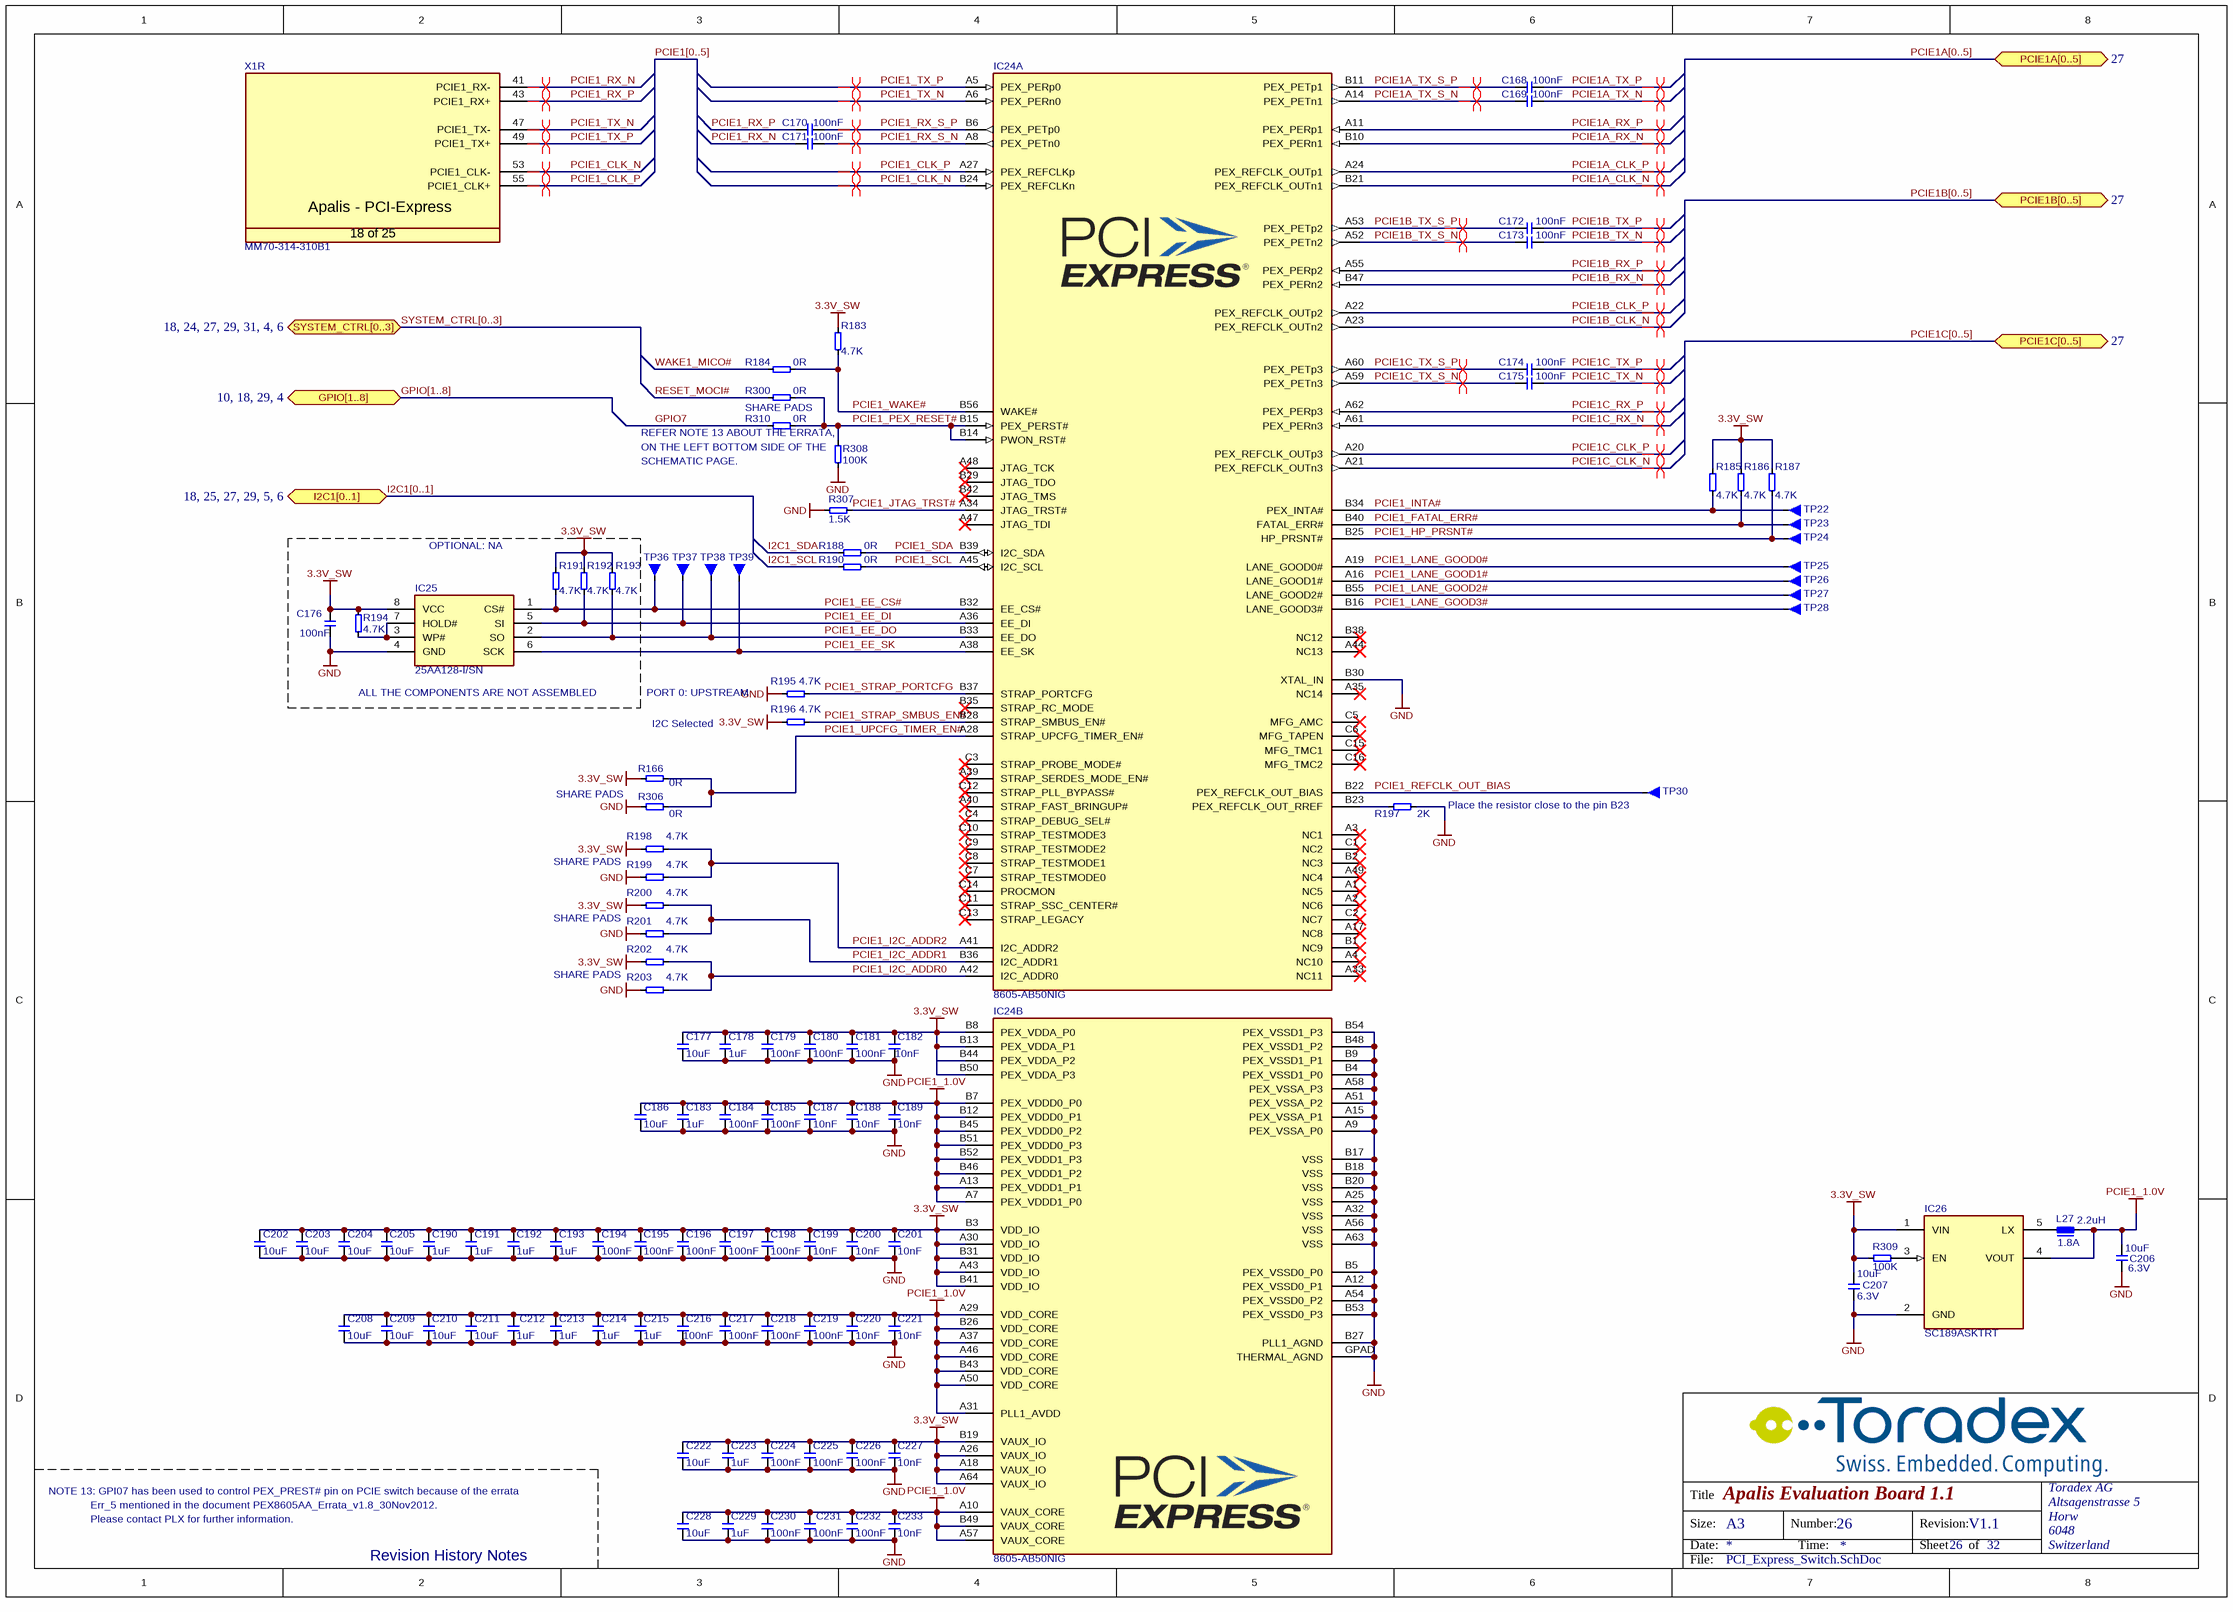
[diagram p12: PCI_Express_Switch.SchDoc]

### Parts
C168  100nF  [CAPC1005X60N]
C169  100nF  [CAPC1005X60N]
C170  100nF  [CAPC1005X60N]
C171  100nF  [CAPC1005X60N]
C172  100nF  [CAPC1005X60N]
C173  100nF  [CAPC1005X60N]
C174  100nF  [CAPC1005X60N]
C175  100nF  [CAPC1005X60N]
C176  100nF  [T_CAPC0603X33N]
C177  10uF  [T_CAPC0603X33N]
C178  1uF  [CAPC1005X60N]
C179  100nF  [CAPC1005X60N]
C180  100nF  [CAPC1005X60N]
C181  100nF  [CAPC1005X60N]
C182  10nF  [CAPC1005X60N]
C183  1uF  [CAPC1005X60N]
C184  100nF  [CAPC1005X60N]
C185  100nF  [CAPC1005X60N]
C186  10uF  [T_CAPC0603X33N]
C187  10nF  [CAPC1005X60N]
C188  10nF  [CAPC1005X60N]
C189  10nF  [CAPC1005X60N]
C190  1uF  [CAPC1005X60N]
C191  1uF  [CAPC1005X60N]
C192  1uF  [CAPC1005X60N]
C193  1uF  [CAPC1005X60N]
C194  100nF  [CAPC1005X60N]
C195  100nF  [CAPC1005X60N]
C196  100nF  [CAPC1005X60N]
C197  100nF  [CAPC1005X60N]
C198  100nF  [CAPC1005X60N]
C199  10nF  [CAPC1005X60N]
C200  10nF  [CAPC1005X60N]
C201  10nF  [CAPC1005X60N]
C202  10uF  [T_CAPC0603X33N]
C203  10uF  [T_CAPC0603X33N]
C204  10uF  [T_CAPC0603X33N]
C205  10uF  [T_CAPC0603X33N]
C206  Rating: 6.3V  [T_CAPC0805X125N]  (hidden comment: 10uF)
C207  Rating: 6.3V  [T_CAPC0805X125N]  (hidden comment: 10uF)
C208  10uF  [T_CAPC0603X33N]
C209  10uF  [T_CAPC0603X33N]
C210  10uF  [T_CAPC0603X33N]
C211  10uF  [T_CAPC0603X33N]
C212  1uF  [CAPC1005X60N]
C213  1uF  [CAPC1005X60N]
C214  1uF  [CAPC1005X60N]
C215  1uF  [CAPC1005X60N]
C216  100nF  [CAPC1005X60N]
C217  100nF  [CAPC1005X60N]
C218  100nF  [CAPC1005X60N]
C219  100nF  [CAPC1005X60N]
C220  10nF  [CAPC1005X60N]
C221  10nF  [CAPC1005X60N]
C222  10uF  [T_CAPC0603X33N]
C223  1uF  [CAPC1005X60N]
C224  100nF  [CAPC1005X60N]
C225  100nF  [CAPC1005X60N]
C226  100nF  [CAPC1005X60N]
C227  10nF  [CAPC1005X60N]
C228  10uF  [T_CAPC0603X33N]
C229  1uF  [CAPC1005X60N]
C230  100nF  [CAPC1005X60N]
C231  100nF  [CAPC1005X60N]
C232  100nF  [CAPC1005X60N]
C233  10nF  [CAPC1005X60N]
IC24  8605-AB50NIG  [QFN50P1000X1000X85-137M]  (parts A,B of 2)
IC25  25AA128-I/SN  [SOIC127P600X173-8N]
IC26  SC189ASKTRT  [SOT95P279X142-5N]
L27  Rating: 1.8A  [T_WURTH_744025002]  (hidden comment: 2.2uH)
R166  0R  [T_RESC0603X30N]
R183  4.7K  [t_RESC0603X30N]
R184  0R  [T_RESC0603X30N]
R185  4.7K  [t_RESC0603X30N]
R186  4.7K  [t_RESC0603X30N]
R187  4.7K  [t_RESC0603X30N]
R188  0R  [T_RESC0603X30N]
R190  0R  [T_RESC0603X30N]
R191  4.7K  [t_RESC0603X30N]
R192  4.7K  [t_RESC0603X30N]
R193  4.7K  [t_RESC0603X30N]
R194  4.7K  [t_RESC0603X30N]
R195  4.7K  [t_RESC0603X30N]
R196  4.7K  [t_RESC0603X30N]
R197  2K  [T_RESC0603X30N]
R198  4.7K  [t_RESC0603X30N]
R199  4.7K  [t_RESC0603X30N]
R200  4.7K  [t_RESC0603X30N]
R201  4.7K  [t_RESC0603X30N]
R202  4.7K  [t_RESC0603X30N]
R203  4.7K  [t_RESC0603X30N]
R300  0R  [T_RESC0603X30N]
R306  0R  [T_RESC0603X30N]
R307  1.5K  [T_RESC0603X30N]
R308  100K  [T_RESC0603X30N]
R309  100K  [T_RESC0603X30N]
R310  0R  [T_RESC0603X30N]
TP22  Testpin  [T_TP-THT]  (value not drawn)
TP23  Testpin  [T_TP-THT]  (value not drawn)
TP24  Testpin  [T_TP-THT]  (value not drawn)
TP25  Testpin  [T_TP-THT]  (value not drawn)
TP26  Testpin  [T_TP-THT]  (value not drawn)
TP27  Testpin  [T_TP-THT]  (value not drawn)
TP28  Testpin  [T_TP-THT]  (value not drawn)
TP30  Testpin  [T_TP-THT]  (value not drawn)
TP36  Testpin  [T_TP-THT]  (value not drawn)
TP37  Testpin  [T_TP-THT]  (value not drawn)
TP38  Testpin  [T_TP-THT]  (value not drawn)
TP39  Testpin  [T_TP-THT]  (value not drawn)
X1  Manufacturer Part No.: MM70-314-310B1  [T_JAE_MM70-314-310B1]  (hidden comment: CON-JAE-MM70-314-310B1-314-0.5mm)  (part R of 25)

### Ports
GPIO[1..8] (bidir, see 10, 18, 29, 4), I2C1[0..1] (bidir, see 18, 25, 27, 29, 5, 6), PCIE1A[0..5] (bidir, see 27), PCIE1B[0..5] (bidir, see 27), PCIE1C[0..5] (bidir, see 27), SYSTEM_CTRL[0..3] (bidir, see 18, 24, 27, 29, 31, 4, 6)

### Nets
3.3V_SW: C176.1 C177.2 C178.2 C179.2 C180.2 C181.2 C182.2 C190.2 C191.2 C192.2 C193.2 C194.2 C195.2 C196.2 C197.2 C198.2 C199.2 C200.2 C201.2 C202.2 C203.2 C204.2 C205.2 C207.2 C222.2 C223.2 C224.2 C225.2 C226.2 C227.2 IC24.A18(VAUX_IO) IC24.A26(VAUX_IO) IC24.A30(VDD_IO) IC24.A43(VDD_IO) IC24.A64(VAUX_IO) IC24.B3(VDD_IO) IC24.B8(PEX_VDDA_P0) IC24.B13(PEX_VDDA_P1) IC24.B19(VAUX_IO) IC24.B31(VDD_IO) IC24.B41(VDD_IO) IC24.B44(PEX_VDDA_P2) IC24.B50(PEX_VDDA_P3) IC25.8(VCC) IC26.1(VIN) R166.2 R183.1 R185.1 R186.1 R187.1 R191.1 R192.1 R193.1 R194.2 R196.2 R198.2 R200.2 R202.2 R309.1
GND: C176.2 C177.1 C178.1 C179.1 C180.1 C181.1 C182.1 C183.1 C184.1 C185.1 C186.1 C187.1 C188.1 C189.1 C190.1 C191.1 C192.1 C193.1 C194.1 C195.1 C196.1 C197.1 C198.1 C199.1 C200.1 C201.1 C202.1 C203.1 C204.1 C205.1 C206.1 C207.1 C208.1 C209.1 C210.1 C211.1 C212.1 C213.1 C214.1 C215.1 C216.1 C217.1 C218.1 C219.1 C220.1 C221.1 C222.1 C223.1 C224.1 C225.1 C226.1 C227.1 C228.1 C229.1 C230.1 C231.1 C232.1 C233.1 IC24.A9(PEX_VSSA_P0) IC24.A12(PEX_VSSD0_P1) IC24.A15(PEX_VSSA_P1) IC24.A25(VSS) IC24.A32(VSS) IC24.A51(PEX_VSSA_P2) IC24.A54(PEX_VSSD0_P2) IC24.A56(VSS) IC24.A58(PEX_VSSA_P3) IC24.A63(VSS) IC24.B4(PEX_VSSD1_P0) IC24.B5(PEX_VSSD0_P0) IC24.B9(PEX_VSSD1_P1) IC24.B17(VSS) IC24.B18(VSS) IC24.B20(VSS) IC24.B27(PLL1_AGND) IC24.B30(XTAL_IN) IC24.B48(PEX_VSSD1_P2) IC24.B53(PEX_VSSD0_P3) IC24.B54(PEX_VSSD1_P3) IC24.GPAD(THERMAL_AGND) IC25.4(GND) IC26.2(GND) R195.1 R197.2 R199.2 R201.2 R203.2 R306.2 R307.1 R308.2
PCIE1_1.0V: C183.2 C184.2 C185.2 C186.2 C187.2 C188.2 C189.2 C206.2 C208.2 C209.2 C210.2 C211.2 C212.2 C213.2 C214.2 C215.2 C216.2 C217.2 C218.2 C219.2 C220.2 C221.2 C228.2 C229.2 C230.2 C231.2 C232.2 C233.2 IC24.A7(PEX_VDDD1_P0) IC24.A10(VAUX_CORE) IC24.A13(PEX_VDDD1_P1) IC24.A29(VDD_CORE) IC24.A31(PLL1_AVDD) IC24.A37(VDD_CORE) IC24.A46(VDD_CORE) IC24.A50(VDD_CORE) IC24.A57(VAUX_CORE) IC24.B7(PEX_VDDD0_P0) IC24.B12(PEX_VDDD0_P1) IC24.B26(VDD_CORE) IC24.B43(VDD_CORE) IC24.B45(PEX_VDDD0_P2) IC24.B46(PEX_VDDD1_P2) IC24.B49(VAUX_CORE) IC24.B51(PEX_VDDD0_P3) IC24.B52(PEX_VDDD1_P3) IC26.4(VOUT) L27.1
GPIO7: R310.1
I2C1_SCL: R190.1
I2C1_SDA: R188.1
PCIE1_CLK_N: IC24.B24(PEX_REFCLKn) X1.53(PCIE1_CLK-)
PCIE1_CLK_P: IC24.A27(PEX_REFCLKp) X1.55(PCIE1_CLK+)
PCIE1_EE_CS#: IC24.B32(EE_CS#) IC25.1(CS#) R191.2 TP36.1
PCIE1_EE_DI: IC24.A36(EE_DI) IC25.5(SI) R192.2 TP37.1
PCIE1_EE_DO: IC24.B33(EE_DO) IC25.2(SO) R193.2 TP38.1
PCIE1_EE_SK: IC24.A38(EE_SK) IC25.6(SCK) TP39.1
PCIE1_FATAL_ERR#: IC24.B40(FATAL_ERR#) R186.2 TP23.1
PCIE1_HP_PRSNT#: IC24.B25(HP_PRSNT#) R187.2 TP24.1
PCIE1_I2C_ADDR0: IC24.A42(I2C_ADDR0) R202.1 R203.1
PCIE1_I2C_ADDR1: IC24.B36(I2C_ADDR1) R200.1 R201.1
PCIE1_I2C_ADDR2: IC24.A41(I2C_ADDR2) R198.1 R199.1
PCIE1_INTA#: IC24.B34(PEX_INTA#) R185.2 TP22.1
PCIE1_JTAG_TRST#: IC24.A34(JTAG_TRST#) R307.2
PCIE1_LANE_GOOD0#: IC24.A19(LANE_GOOD0#) TP25.1
PCIE1_LANE_GOOD1#: IC24.A16(LANE_GOOD1#) TP26.1
PCIE1_LANE_GOOD2#: IC24.B55(LANE_GOOD2#) TP27.1
PCIE1_LANE_GOOD3#: IC24.B16(LANE_GOOD3#) TP28.1
PCIE1_PEX_RESET#: IC24.B14(PWON_RST#) IC24.B15(PEX_PERST#) R300.2 R308.1 R310.2
PCIE1_REFCLK_OUT_BIAS: IC24.B22(PEX_REFCLK_OUT_BIAS) TP30.1
PCIE1_RX_N: C171.1 X1.41(PCIE1_RX-)
PCIE1_RX_P: C170.1 X1.43(PCIE1_RX+)
PCIE1_RX_S_N: C171.2 IC24.A8(PEX_PETn0)
PCIE1_RX_S_P: C170.2 IC24.B6(PEX_PETp0)
PCIE1_SCL: IC24.A45(I2C_SCL) R190.2
PCIE1_SDA: IC24.B39(I2C_SDA) R188.2
PCIE1_STRAP_PORTCFG: IC24.B37(STRAP_PORTCFG) R195.2
PCIE1_STRAP_SMBUS_EN#: IC24.B28(STRAP_SMBUS_EN#) R196.1
PCIE1_TX_N: IC24.A6(PEX_PERn0) X1.47(PCIE1_TX-)
PCIE1_TX_P: IC24.A5(PEX_PERp0) X1.49(PCIE1_TX+)
PCIE1_UPCFG_TIMER_EN#: IC24.A28(STRAP_UPCFG_TIMER_EN#) R166.1 R306.1
PCIE1_WAKE#: IC24.B56(WAKE#) R183.2 R184.2
PCIE1A_CLK_N: IC24.B21(PEX_REFCLK_OUTn1)
PCIE1A_CLK_P: IC24.A24(PEX_REFCLK_OUTp1)
PCIE1A_RX_N: IC24.B10(PEX_PERn1)
PCIE1A_RX_P: IC24.A11(PEX_PERp1)
PCIE1A_TX_N: C169.2
PCIE1A_TX_P: C168.2
PCIE1A_TX_S_N: C169.1 IC24.A14(PEX_PETn1)
PCIE1A_TX_S_P: C168.1 IC24.B11(PEX_PETp1)
PCIE1B_CLK_N: IC24.A23(PEX_REFCLK_OUTn2)
PCIE1B_CLK_P: IC24.A22(PEX_REFCLK_OUTp2)
PCIE1B_RX_N: IC24.B47(PEX_PERn2)
PCIE1B_RX_P: IC24.A55(PEX_PERp2)
PCIE1B_TX_N: C173.2
PCIE1B_TX_P: C172.2
PCIE1B_TX_S_N: C173.1 IC24.A52(PEX_PETn2)
PCIE1B_TX_S_P: C172.1 IC24.A53(PEX_PETp2)
PCIE1C_CLK_N: IC24.A21(PEX_REFCLK_OUTn3)
PCIE1C_CLK_P: IC24.A20(PEX_REFCLK_OUTp3)
PCIE1C_RX_N: IC24.A61(PEX_PERn3)
PCIE1C_RX_P: IC24.A62(PEX_PERp3)
PCIE1C_TX_N: C175.2
PCIE1C_TX_P: C174.2
PCIE1C_TX_S_N: C175.1 IC24.A59(PEX_PETn3)
PCIE1C_TX_S_P: C174.1 IC24.A60(PEX_PETp3)
RESET_MOCI#: R300.1
WAKE1_MICO#: R184.1
NetIC24_B23: IC24.B23(PEX_REFCLK_OUT_RREF) R197.1
NetIC25_3: IC25.3(WP#) IC25.7(HOLD#) R194.1
NetIC26_3: IC26.3(EN) R309.2
NetIC26_5: IC26.5(LX) L27.2

Not connected (* = marked no-connect by the designer): IC24 A1(NC5)* A2(NC6)* A3(NC1)* A4(NC10)* A17(NC8)* A33(NC11)* A35(NC14)* A39(STRAP_SERDES_MODE_EN#)* A40(STRAP_FAST_BRINGUP#)* A44(NC13)* A47(JTAG_TDI)* A48(JTAG_TCK)* A49(NC4)* B1(NC9)* B2(NC3)* B29(JTAG_TDO)* B35(STRAP_RC_MODE)* B38(NC12)* B42(JTAG_TMS)* C1(NC2)* C2(NC7)* C3(STRAP_PROBE_MODE#)* C4(STRAP_DEBUG_SEL#)* C5(MFG_AMC)* C6(MFG_TAPEN)* C7(STRAP_TESTMODE0)* C8(STRAP_TESTMODE1)* C9(STRAP_TESTMODE2)* C10(STRAP_TESTMODE3)* C11(STRAP_SSC_CENTER#)* C12(STRAP_PLL_BYPASS#)* C13(STRAP_LEGACY)* C14(PROCMON)* C15(MFG_TMC1)* C16(MFG_TMC2)*

### Buses and harness runs
bus GPIO[1..8] = port GPIO[1..8]
bus I2C1[0..1] = port I2C1[0..1]
bus PCIE1[0..5]
bus PCIE1A[0..5] = port PCIE1A[0..5]
bus PCIE1B[0..5] = port PCIE1B[0..5]
bus PCIE1C[0..5] = port PCIE1C[0..5]
bus SYSTEM_CTRL[0..3] = port SYSTEM_CTRL[0..3]

### Layout directives
differential pair: PCIE1_CLK_N, PCIE1_CLK_P, PCIE1_RX_N, PCIE1_RX_P, PCIE1_RX_S_N, PCIE1_RX_S_P, PCIE1_TX_N, PCIE1_TX_P, PCIE1A_CLK_N, PCIE1A_CLK_P, PCIE1A_RX_N, PCIE1A_RX_P, PCIE1A_TX_N, PCIE1A_TX_P, PCIE1A_TX_S_N, PCIE1A_TX_S_P, PCIE1B_CLK_N, PCIE1B_CLK_P, PCIE1B_RX_N, PCIE1B_RX_P, PCIE1B_TX_N, PCIE1B_TX_P, PCIE1B_TX_S_N, PCIE1B_TX_S_P, PCIE1C_CLK_N, PCIE1C_CLK_P, PCIE1C_RX_N, PCIE1C_RX_P, PCIE1C_TX_N, PCIE1C_TX_P, PCIE1C_TX_S_N, PCIE1C_TX_S_P

### Notes on the sheet
- (near R310) REFER NOTE 13 ABOUT THE ERRATA,
- (near R310) ON THE LEFT BOTTOM SIDE OF THE
- SCHEMATIC PAGE.
- SHARE PADS
- OPTIONAL: NA
- ALL THE COMPONENTS ARE NOT ASSEMBLED
- PORT 0: UPSTREAM
- I2C Selected
- (near TP30) Place the resistor close to the pin B23
- NOTE 13: GPI07 has been used to control PEX_PREST# pin on PCIE switch because of the errata
- Err_5 mentioned in the document PEX8605AA_Errata_v1.8_30Nov2012.
- Please contact PLX for further information.
- Revision History Notes
- Title
- Size:
- Date:
- A3
- Number:
- Time:
- Revision:
- Sheet
- of
- File:
- (in symbol CON-JAE-MM70-314-310B1-314-0.5mm, part R) Apalis - PCI-Express; 18 of 25

### Library data of the parts
C168-C175 C179-C181 C184 C185 C194-C198 C216-C219 C224-C226 C230-C232 = C-X7R-100nF-16V-10%-0402: Capacitor Ceramic X7R 100nF 16V 10% 0402; Tolerance: 10%; Type: X7R; Value: 100nF
C176 = C-X7R-100nF-16V-10%-0603: Capacitor Ceramic X7R 100nF 16V 10% 0603; Tolerance: 10%; Type: X7R; Value: 100nF
C177 C186 C202-C205 C208-C211 C222 C228 = C-X5R-10uF-6.3V-20%-0603: Capacitor Ceramic X5R 10uF 6.3V 20% 0603; Tolerance: 20%; Type: X5R; Value: 10uF
C178 C183 C190-C193 C212-C215 C223 C229 = C-X5R-1uF-16V-10%-0402: Capacitor Ceramic X5R 1uF 16V 10% 0402; Tolerance: 10%; Type: X5R; Value: 1uF
C182 C187-C189 C199-C201 C220 C221 C227 C233 = C-X7R-10nF-25V-10%-0402: Capacitor Ceramic X7R 10nF 25V 10% 0402; Tolerance: 10%; Type: X7R; Value: 10nF
C206 C207 = C-X5R-10uF-6.3V-10%-0805: Capacitor Ceramic X5R 10uF 6.3V 10% 0805; Tolerance: 10%; Type: X5R; Value: 10uF
IC24 = IC-PLX-8605-AB50NIG: 4 Ports 4 Lane PCIe Gen2 switch; Manufacturer Name: PLX; Manufacturer Part No.: 8605-AB50NIG
IC25 = IC-MC-25AA128-I/SN: 128K SPI Bus Serial EEPROM; Manufacturer Name: Microchip; Manufacturer Part No.: 25AA128-I/SN
IC26 = IC-Semtech-SC189ASKTRT: SC189ASKTRT 1.5A Synchronous  Step Down Regulator; Manufacturer Name: Semtech; Manufacturer Part No.: SC189ASKTRT
L27 = L-Wurth-744025002-2.2u-1.8A-20%: Power Choke 744025002-2.2u-1.8A-20%; Manufacturer Name: Wurth; Tolerance: 20%; Manufacturer Part No.: 744025002; Value: 2.2uH
R166 R184 R188 R190 R300 R306 R310 = R-0R-63mW-1%-0603: Resistor 0 ohm 63mW 1% 0603; Rating: 63mW; Tolerance: 1%; Value: 0R
R183 R185-R187 R191-R196 R198-R203 = R-4.7kR-63mW-5%-0603: as R256 on sheet PCI_Express_Connectors; Rating: 63mW; Tolerance: 5%
R197 = R-2KR-63mW-1%-0603: Resistor 2Kohm 63mW 1% 0603; Value: 2KR; Rating: 63mW; Tolerance: 1%
R307 = R-1.5KR-63mW-5%-0603: Resistor 1.5 Kohm 63mW 5% 0603; Value: 1.5KR; Rating: 63mW; Tolerance: 5%
R308 R309 = R-100KR-63mW-5%-0603: as R109 on sheet LEDs_Switches; Rating: 63mW; Tolerance: 5%
TP22-TP28 TP30 TP36-TP39 = Testpin: Testpin TH
X1 = CON-JAE-MM70-314-310B1-314-0.5mm: MXM3 Connector; Manufacturer Name: JAE; No. of ways: 314

## Sheet Power_Supply.SchDoc: Apalis Evaluation Board 1.1
size A3; Organization: Toradex AG; Address1: Altsagenstrasse 5; Address2: Horw; Address3: 6048; Address4: Switzerland; DocumentNumber: 3; Revision: V1.1; SheetNumber: 3; SheetTotal: 32; PageSetup: Record=PageOptions|CenterHorizontal=True|CenterVertical=True|PrintScale=0.73|XCorrection=1.00|YCorrection=1.00|PrintKind=0|BorderSize=5000000|LeftOffset=0|BottomOffset=0|Orientation=2|PaperLength=1000|PaperWidth=1000|Scale=100|PaperSource=7|PrintQuality=-4|MediaType=1|DitherType=10|PaperKind=A4|PrintScaleMode=1
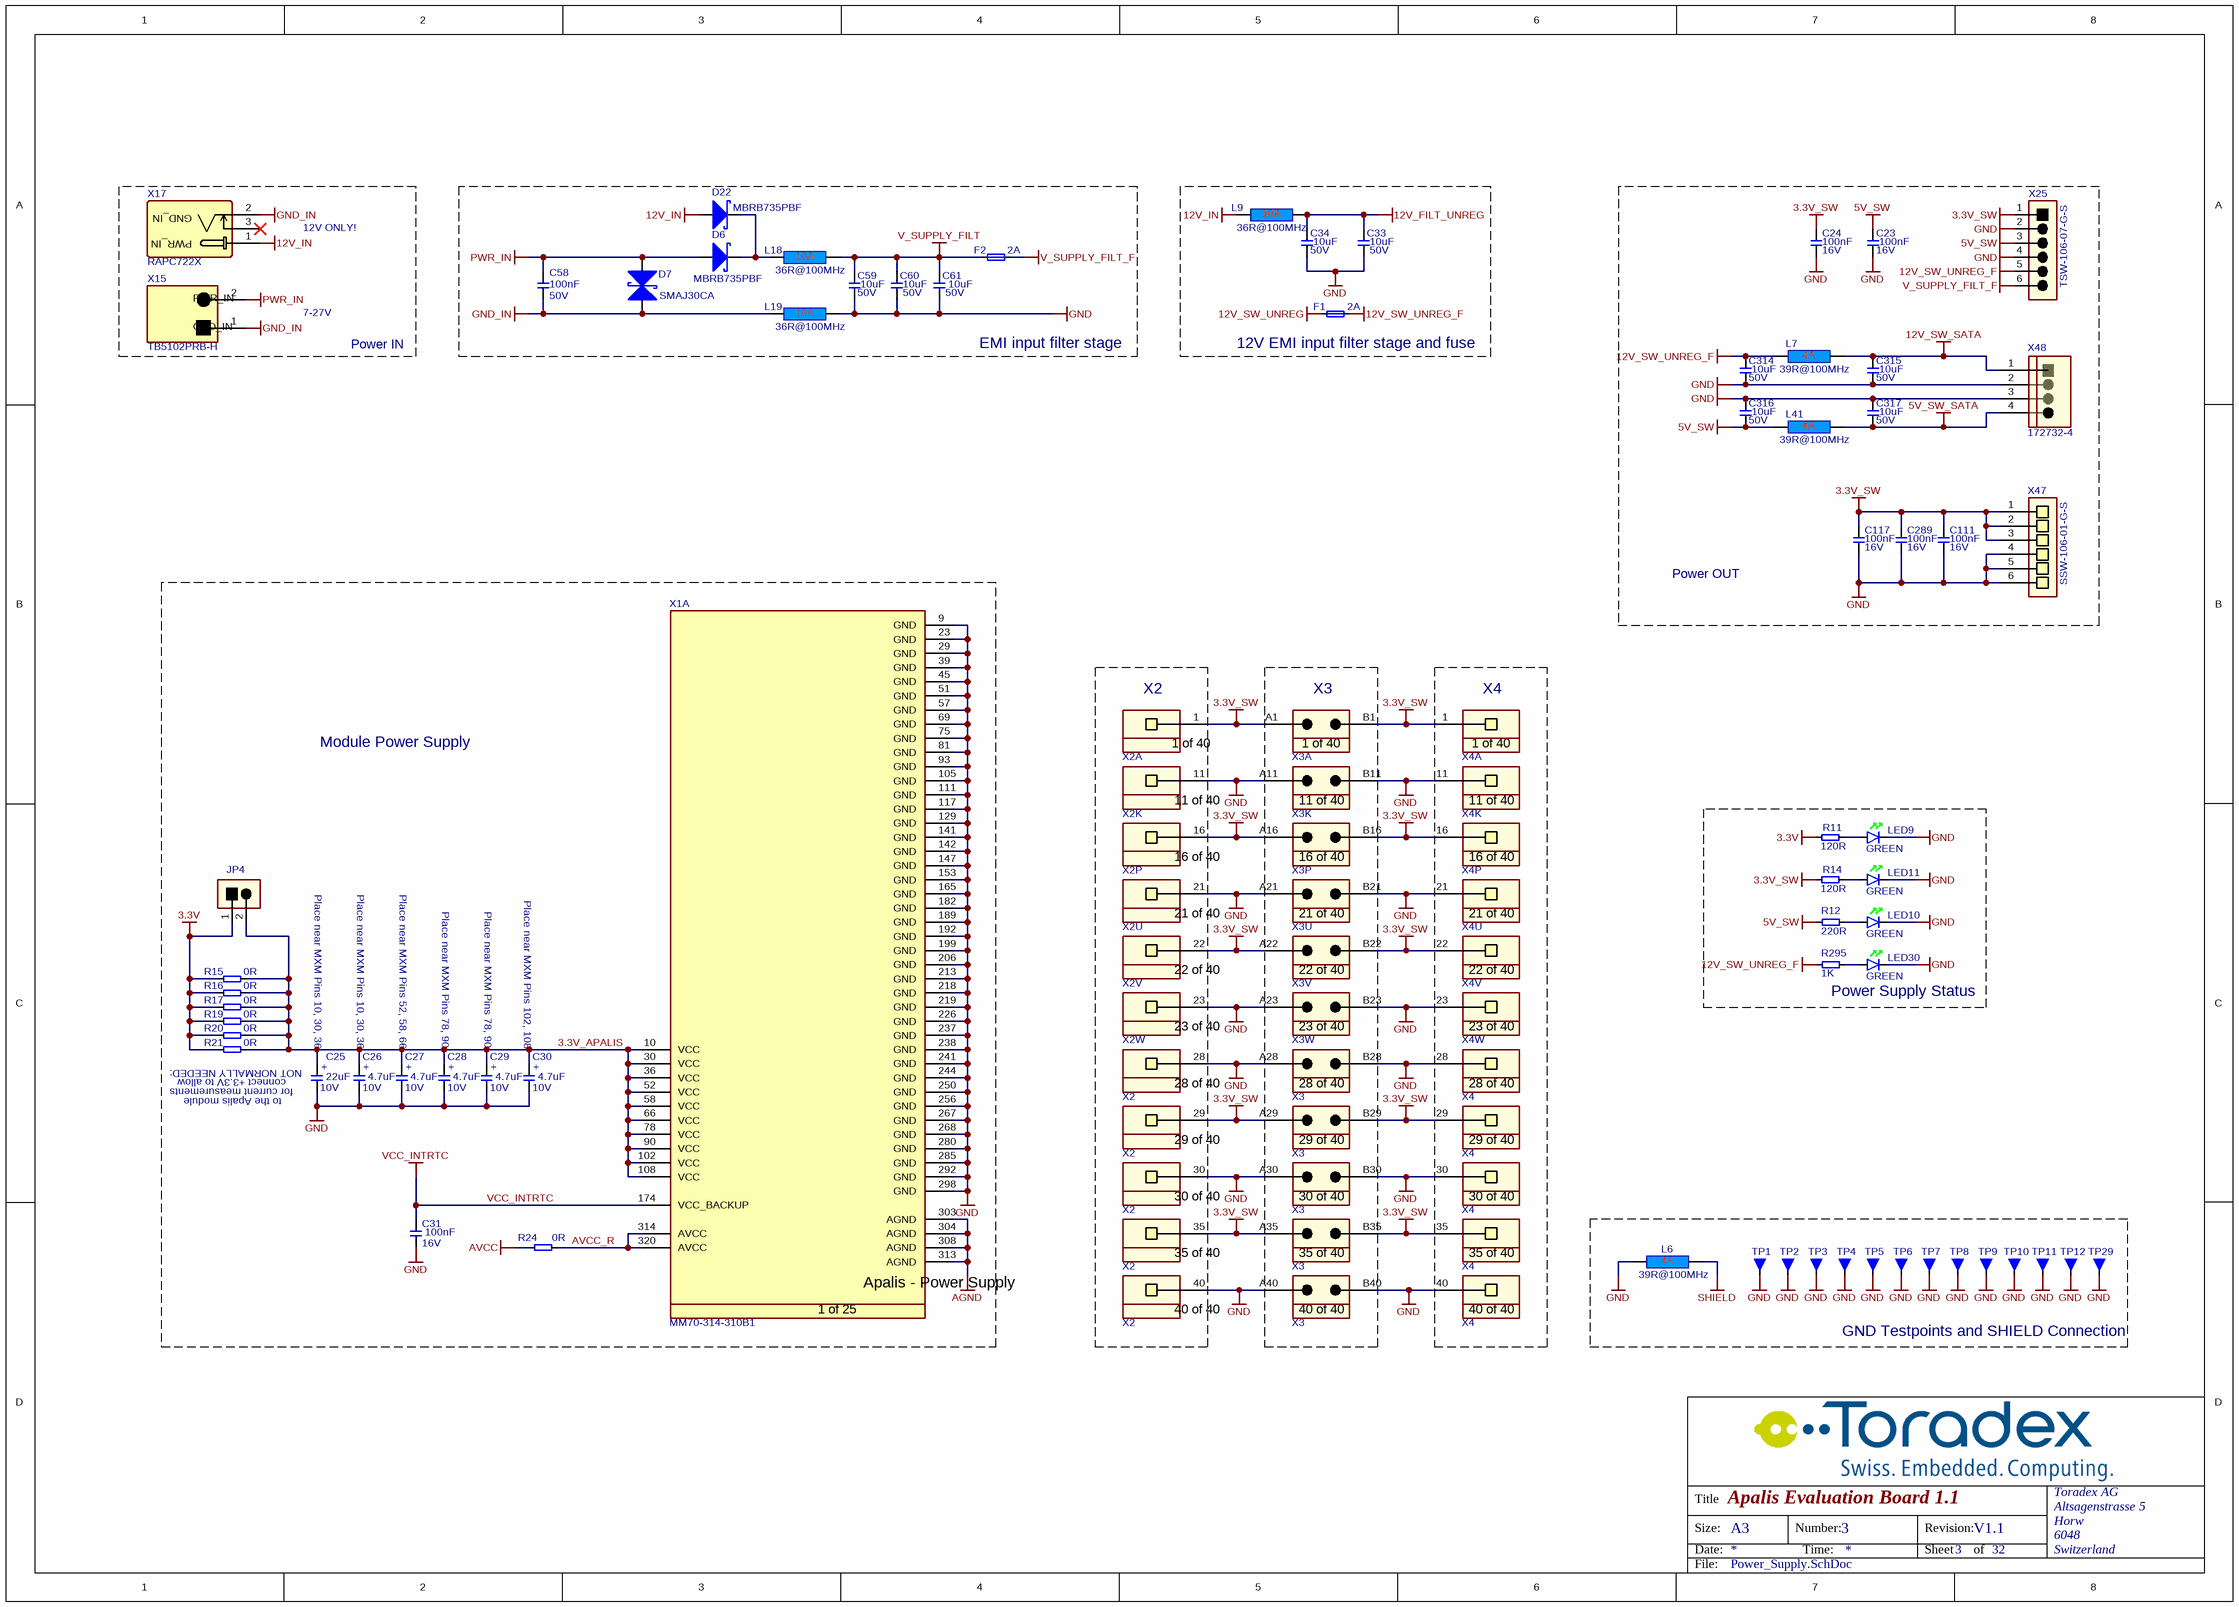
[diagram p13: Power_Supply.SchDoc]

### Parts
C23  Rating: 16V  [T_CAPC0603X33N]  (hidden comment: 100nF)
C24  Rating: 16V  [T_CAPC0603X33N]  (hidden comment: 100nF)
C25  Rating: 10V  [CAPMP3528X210N]  (hidden comment: 22uF)
C26  Rating: 10V  [T_CAPMP3216X180N]  (hidden comment: 4.7uF)
C27  Rating: 10V  [T_CAPMP3216X180N]  (hidden comment: 4.7uF)
C28  Rating: 10V  [T_CAPMP3216X180N]  (hidden comment: 4.7uF)
C29  Rating: 10V  [T_CAPMP3216X180N]  (hidden comment: 4.7uF)
C30  Rating: 10V  [T_CAPMP3216X180N]  (hidden comment: 4.7uF)
C31  Rating: 16V  [T_CAPC0603X33N]  (hidden comment: 100nF)
C33  Rating: 50V  [CAPC3225X160N]  (hidden comment: 10uF)
C34  Rating: 50V  [CAPC3225X160N]  (hidden comment: 10uF)
C58  Rating: 50V  [T_CAPC0603X33N]  (hidden comment: 100nF)
C59  Rating: 50V  [CAPC3225X160N]  (hidden comment: 10uF)
C60  Rating: 50V  [CAPC3225X160N]  (hidden comment: 10uF)
C61  Rating: 50V  [CAPC3225X160N]  (hidden comment: 10uF)
C111  Rating: 16V  [T_CAPC0603X33N]  (hidden comment: 100nF)
C117  Rating: 16V  [T_CAPC0603X33N]  (hidden comment: 100nF)
C289  Rating: 16V  [T_CAPC0603X33N]  (hidden comment: 100nF)
C314  Rating: 50V  [CAPC3225X160N]  (hidden comment: 10uF)
C315  Rating: 50V  [CAPC3225X160N]  (hidden comment: 10uF)
C316  Rating: 50V  [CAPC3225X160N]  (hidden comment: 10uF)
C317  Rating: 50V  [CAPC3225X160N]  (hidden comment: 10uF)
D6  MBRB735PBF  [T_VISHAY_MBRB735PBF]
D7  Manufacturer Part No.: SMAJ30CA  [T_LITTLEFUSE_SMAJ30CA]  (hidden comment: D-Littelfuse-SMAJ30CA-Schottky)
D22  MBRB735PBF  [T_VISHAY_MBRB735PBF]
F1  2A  [T_Littelfuse_0458]
F2  2A  [T_Littelfuse_0458]
JP4  TSW-101-07-G-D  [T_Samtec_TSW-101-07-G-D]  (value not drawn)
L6  39R@100MHz  [INDC2013X130N]
L7  39R@100MHz  [INDC2013X130N]
L9  36R@100MHz  [T_Laird_35F0121-0SR-10]
L18  36R@100MHz  [T_Laird_35F0121-0SR-10]
L19  36R@100MHz  [T_Laird_35F0121-0SR-10]
L41  39R@100MHz  [INDC2013X130N]
LED9  Color: GREEN  [T_Osram_T670_GREEN]  (hidden comment: LG T670-K1L2-1)
LED10  Color: GREEN  [T_Osram_T670_GREEN]  (hidden comment: LG T670-K1L2-1)
LED11  Color: GREEN  [T_Osram_T670_GREEN]  (hidden comment: LG T670-K1L2-1)
LED30  Color: GREEN  [T_Osram_T670_GREEN]  (hidden comment: LG T670-K1L2-1)
R11  120R  [T_RESC0603X30N]
R12  220R  [T_RESC0603X30N]
R14  120R  [T_RESC0603X30N]
R15  0R  [T_RESC3216X760N]
R16  0R  [T_RESC3216X760N]
R17  0R  [T_RESC3216X760N]
R19  0R  [T_RESC3216X760N]
R20  0R  [T_RESC3216X760N]
R21  0R  [T_RESC3216X760N]
R24  0R  [T_RESC0603X30N]
R295  1K  [T_RESC0603X30N]
TP1  5011  [T_TP-THT - EYE]  (value not drawn)
TP2  5011  [T_TP-THT - EYE]  (value not drawn)
TP3  5011  [T_TP-THT - EYE]  (value not drawn)
TP4  5011  [T_TP-THT - EYE]  (value not drawn)
TP5  5011  [T_TP-THT - EYE]  (value not drawn)
TP6  5011  [T_TP-THT - EYE]  (value not drawn)
TP7  5011  [T_TP-THT - EYE]  (value not drawn)
TP8  5011  [T_TP-THT - EYE]  (value not drawn)
TP9  5011  [T_TP-THT - EYE]  (value not drawn)
TP10  5011  [T_TP-THT - EYE]  (value not drawn)
TP11  5011  [T_TP-THT - EYE]  (value not drawn)
TP12  5011  [T_TP-THT - EYE]  (value not drawn)
TP29  5011  [T_TP-THT - EYE]  (value not drawn)
X1  Manufacturer Part No.: MM70-314-310B1  [T_JAE_MM70-314-310B1]  (hidden comment: CON-JAE-MM70-314-310B1-314-0.5mm)  (part A of 25)
X2  SSW-110-01-G-S  [T_Samtec_SSW-110-01-G-S]  (value not drawn)  (parts A,K,P,U,V,W,28,29,30,35,40 of 40)
X3  TSW-110-07-G-D  [T_Samtec_TSW-110-07-G-D]  (value not drawn)  (parts A,K,P,U,V,W,28,29,30,35,40 of 40)
X4  SSW-110-01-G-S  [T_Samtec_SSW-110-01-G-S]  (value not drawn)  (parts A,K,P,U,V,W,28,29,30,35,40 of 40)
X15  TB5102PRB-H  [T_AUK_TB5102PRB-H]
X17  RAPC722X  [T_DCJ20-0014TB-L]
X25  TSW-106-07-G-S  [T_samtech_TSW-106-07-G-S]
X47  SSW-106-01-G-S  [T_samtech_SSW-106-01-G-S]
X48  172732-4  [T_TE_172732-4]

### Blocks framed on the sheet
Power IN: X15 X17
EMI input filter stage: C58-C61 D6 D7 D22 F2 L18 L19
12V EMI input filter stage and fuse: C33 C34 F1 L9
Power OUT: C23 C24 C111 C117 C289 C314-C317 L7 L41 X25 X47 X48
Module Power Supply: C25-C31 JP4 R15-R17 R19-R21 R24 X1
X2: X2
X3: X3
X4: X4
Power Supply Status: LED9-LED11 LED30 R11 R12 R14 R295
GND Testpoints and SHIELD Connection: L6 TP1-TP12 TP29

### Nets
3.3V: JP4.1 R11.1 R15.1 R16.1 R17.1 R19.1 R20.1 R21.1
3.3V_SW: C24.2 C111.2 C117.2 C289.2 R14.1 X2.1 X2.16 X2.22 X2.29 X2.35 X3.A1 X3.A16 X3.A22 X3.A29 X3.A35 X3.B1 X3.B16 X3.B22 X3.B29 X3.B35 X4.1 X4.16 X4.22 X4.29 X4.35 X25.1 X47.1 X47.2 X47.3
5V_SW: C23.1 C316.1 L41.1 R12.1 X25.3
5V_SW_SATA: C317.1 L41.2 X48.4(5V)
12V_FILT_UNREG: C33.2 C34.2 L9.2
12V_IN: D22.3 L9.1 X17.1(GND_IN)
12V_SW_SATA: C315.2 L7.2 X48.1(12V)
12V_SW_UNREG: F1.1
12V_SW_UNREG_F: C314.2 F1.2 L7.1 R295.1 X25.5
AGND: X1.303(AGND) X1.304(AGND) X1.308(AGND) X1.313(AGND)
AVCC: R24.1
GND: C23.2 C24.1 C25.2 C26.2 C27.2 C28.2 C29.2 C30.2 C31.1 C33.1 C34.1 C59.1 C60.1 C61.1 C111.1 C117.1 C289.1 C314.1 C315.1 C316.2 C317.2 L6.1 L19.2 LED9.K LED10.K LED11.K LED30.K TP1.1 TP2.1 TP3.1 TP4.1 TP5.1 TP6.1 TP7.1 TP8.1 TP9.1 TP10.1 TP11.1 TP12.1 TP29.1 X1.9(GND) X1.23(GND) X1.29(GND) X1.39(GND) X1.45(GND) X1.51(GND) X1.57(GND) X1.69(GND) X1.75(GND) X1.81(GND) X1.93(GND) X1.105(GND) X1.111(GND) X1.117(GND) X1.129(GND) X1.141(GND) X1.142(GND) X1.147(GND) X1.153(GND) X1.165(GND) X1.182(GND) X1.189(GND) X1.192(GND) X1.199(GND) X1.206(GND) X1.213(GND) X1.218(GND) X1.219(GND) X1.226(GND) X1.237(GND) X1.238(GND) X1.241(GND) X1.244(GND) X1.250(GND) X1.256(GND) X1.267(GND) X1.268(GND) X1.280(GND) X1.285(GND) X1.292(GND) X1.298(GND) X2.11 X2.21 X2.23 X2.28 X2.30 X2.40 X3.A11 X3.A21 X3.A23 X3.A28 X3.A30 X3.A40 X3.B11 X3.B21 X3.B23 X3.B28 X3.B30 X3.B40 X4.11 X4.21 X4.23 X4.28 X4.30 X4.40 X25.2 X25.4 X47.4 X47.5 X47.6 X48.2(GND) X48.3(GND)
GND_IN: C58.1 D7.2(Anode) L19.1 X15.1(GND_IN) X17.2(PWR_IN)
PWR_IN: C58.2 D6.3 D7.1(Cathode) X15.2(PWR_IN)
SHIELD: L6.2
V_SUPPLY_FILT: C59.2 C60.2 C61.2 F2.1 L18.2
V_SUPPLY_FILT_F: F2.2 X25.6
VCC_INTRTC: C31.2 X1.174(VCC_BACKUP)
3.3V_APALIS: C25.1 C26.1 C27.1 C28.1 C29.1 C30.1 JP4.2 R15.2 R16.2 R17.2 R19.2 R20.2 R21.2 X1.10(VCC) X1.30(VCC) X1.36(VCC) X1.52(VCC) X1.58(VCC) X1.66(VCC) X1.78(VCC) X1.90(VCC) X1.102(VCC) X1.108(VCC)
AVCC_R: R24.2 X1.314(AVCC) X1.320(AVCC)
NetD6_2: D6.2 D22.2 L18.1
NetLED9_A: LED9.A R11.2
NetLED10_A: LED10.A R12.2
NetLED11_A: LED11.A R14.2
NetLED30_A: LED30.A R295.2

Not connected (* = marked no-connect by the designer): X17 3(PWR_IN)*

### Notes on the sheet
- 12V ONLY!
- 7-27V
- (near C25) Place near MXM Pins 10, 30, 36
- (near C26) Place near MXM Pins 10, 30, 36
- (near C27) Place near MXM Pins 52, 58, 66
- Place near MXM Pins 78, 90
- Place near MXM Pins 102, 108
- to the Apalis module
- connect +3.3V to allow
- for current measurements
- NOT NORMALLY NEEDED:
- Title
- Size:
- Date:
- A3
- Number:
- Time:
- Revision:
- Sheet
- of
- File:
- (in symbol C-TA-4.7uF-10V-20%-3216) +
- (in symbol C-TA-22uF-10V-20%-3528) +
- (in symbol CON-JAE-MM70-314-310B1-314-0.5mm, part A) Apalis - Power Supply; 1 of 25
- (in symbol CON-Samtec-SSW-110-01-G-S, part A) 1 of 40
- (in symbol CON-Samtec-SSW-110-01-G-S, part K) 11 of 40
- (in symbol CON-Samtec-SSW-110-01-G-S, part P) 16 of 40
- (in symbol CON-Samtec-SSW-110-01-G-S, part U) 21 of 40
- (in symbol CON-Samtec-SSW-110-01-G-S, part V) 22 of 40
- (in symbol CON-Samtec-SSW-110-01-G-S, part W) 23 of 40
- (in symbol CON-Samtec-SSW-110-01-G-S, part 28) 28 of 40
- (in symbol CON-Samtec-SSW-110-01-G-S, part 29) 29 of 40
- (in symbol CON-Samtec-SSW-110-01-G-S, part 30) 30 of 40
- (in symbol CON-Samtec-SSW-110-01-G-S, part 35) 35 of 40
- (in symbol CON-Samtec-SSW-110-01-G-S, part 40) 40 of 40
- (in symbol CON-Samtec-TSW-110-07-G-D, part A) 1 of 40
- (in symbol CON-Samtec-TSW-110-07-G-D, part K) 11 of 40
- (in symbol CON-Samtec-TSW-110-07-G-D, part P) 16 of 40
- (in symbol CON-Samtec-TSW-110-07-G-D, part U) 21 of 40
- (in symbol CON-Samtec-TSW-110-07-G-D, part V) 22 of 40
- (in symbol CON-Samtec-TSW-110-07-G-D, part W) 23 of 40
- (in symbol CON-Samtec-TSW-110-07-G-D, part 28) 28 of 40
- (in symbol CON-Samtec-TSW-110-07-G-D, part 29) 29 of 40
- (in symbol CON-Samtec-TSW-110-07-G-D, part 30) 30 of 40
- (in symbol CON-Samtec-TSW-110-07-G-D, part 35) 35 of 40
- (in symbol CON-Samtec-TSW-110-07-G-D, part 40) 40 of 40

### Library data of the parts
C23 C24 C31 C111 C117 C289 = C-X7R-100nF-16V-10%-0603: Capacitor Ceramic X7R 100nF 16V 10% 0603; Tolerance: 10%; Type: X7R; Value: 100nF
C25 = C-TA-22uF-10V-20%-3528: Capacitor TA 22uF 10V 20% 3528; Tolerance: 20%; Type: TA; Value: 22uF
C26-C30 = C-TA-4.7uF-10V-20%-3216: Capacitor TA 4.7uF 10V 20% 3216; Tolerance: 20%; Type: TA; Value: 4.7uF
C33 C34 C59-C61 C314-C317 = C-X5R-10uF-50V-20%-1210: Capacitor Ceramic X5R 10uF 50V 20% 1210; Tolerance: 20%; Type: X5R; Value: 10uF
C58 = C-X7R-100nF-50V-20%-0603: Capacitor Ceramic X7R 100nF 50V 20% 0603; Tolerance: 20%; Type: X7R; Value: 100nF
D6 D22 = D-VISHAY-MBRB735PBF: MBRB735PBF Schottky Diode; Manufacturer Name: Vishay; Manufacturer Part No.: MBRB735PBF
D7 = D-Littelfuse-SMAJ30CA-Schottky: Bidirectional ESD protection; Manufacturer Name: Littelfuse
F1 F2 = F-Littelfuse-0458002: Fuse 2A Fast; Manufacturer Name: Littelfuse; Manufacturer Part No.: 0458002; Value: 2A
JP4 = CON-Samtec-TSW-101-07-G-D: as JP23 on sheet PCI_Express_Connectors; No. of ways: 1x2; Manufacturer Part no.: TSW-101-07-G-D
L6 L7 L41 = L-Panasonic-EXC-ML20A390U-39R@100MHz-4A-25%-0805: 39R@100MHz 4A EMI FILTER; Tolerance: 25%; Rating: 4A; Manufacturer Name: Panasonic; Manufacturer Name: EXC-ML20A390U; Value: 39R@100MHz
L9 L18 L19 = L-Laird-35F0121-0SR-10-10A-25%: Power Supply FB 10A; Tolerance: 25%; Rating: 10A; Value: 36R@100MHz
LED9-LED11 LED30 = LED-Osram-T670-K1L2-1: LED green Osram LG T670-K1L2-1; Manufacturer Name: Osram; Manufacturer Part No.: LG T670-K1L2-1
R11 R14 = R-120R-63mW-5%-0603: Resistor 120 ohm 63mW 5% 0603; Rating: 63mW; Tolerance: 5%; Value: 120R
R12 = R-220R-63mW-5%-0603: Resistor 220 ohm 63mW 5% 0603; Rating: 63mW; Tolerance: 5%; Value: 220R
R15-R17 R19-R21 = R-0R-63mW-1%-1206: Resistor 0 ohm 63mW 1% 1206; Rating: 63mW; Tolerance: 1%; Value: 0R
R24 = R-0R-63mW-1%-0603: Resistor 0 ohm 63mW 1% 0603; Rating: 63mW; Tolerance: 1%; Value: 0R
R295 = R-1KR-63mW-5%-0603: Resistor 1 Kohm 63mW 5% 0603; Rating: 63mW; Tolerance: 5%; Value: 1K
TP1-TP12 TP29 = TP-Keystone-5011: Testpin Eye TH; Manufacturer Name: Keystone; Manufacturer Part No.: 5011
X1 = CON-JAE-MM70-314-310B1-314-0.5mm: as X1 on sheet PCI_Express_Switch
X2 X4 = CON-Samtec-SSW-110-01-G-S: Receptacle Female Socket 1x40 pin 2.54mm pitch; Manufacturer Name: Samtec; Pitch: 2.54mm; No. of ways: 1x40; Manufacturer Part No.: SSW-110-01-G-S
X3 = CON-Samtec-TSW-110-07-G-D: Header 2x40 pin 2.54mm pitch; Manufacturer Name: Samtec; Pitch: 2.54mm; No. of ways: 2x40; Manufacturer Part No.: TSW-110-07-G-D
X15 = CON-AUK-TB5102PRB-H-1x2-50.8mm: Power Connector; Manufacturer Name: AUK; No. of ways: 1x2; Pitch: 5.08mm; Manufacturer Part No.: TB5102PRB-H
X17 = CON-SWC-RAPC722X: Power Jack; Manufacturer Name: SWC; Manufacturer Part No.: RAPC722X
X25 = CON-Samtec-TSW-106-07-G-S: Header male, 1X6 Pins, 2.54 mm pitch; Manufacturer Name: Samtec; Pitch: 2.54 mm; No. of ways: 1X6; Manufacturer Part No.: TSW-106-07-G-S
X47 = CON-Samtec-SSW-106-01-G-S: Receptacle Female Socket, 1x6 Pins, 2.54mm pitch; Manufacturer Name: Samtec; No. of ways: 1x6; Pitch: 2.54mm; Manufacturer Part No.: SSW-106-01-G-S
X48 = CON-TECon-172732-4: Header 4 pos Vert Kink Pin; Manufacturer Name: TE Connectivity; No. of ways: 4; Manufacturer Part No.: 172732-4